# Altium project mcHFPro_rf.PrjPcb (part 1 of 2)
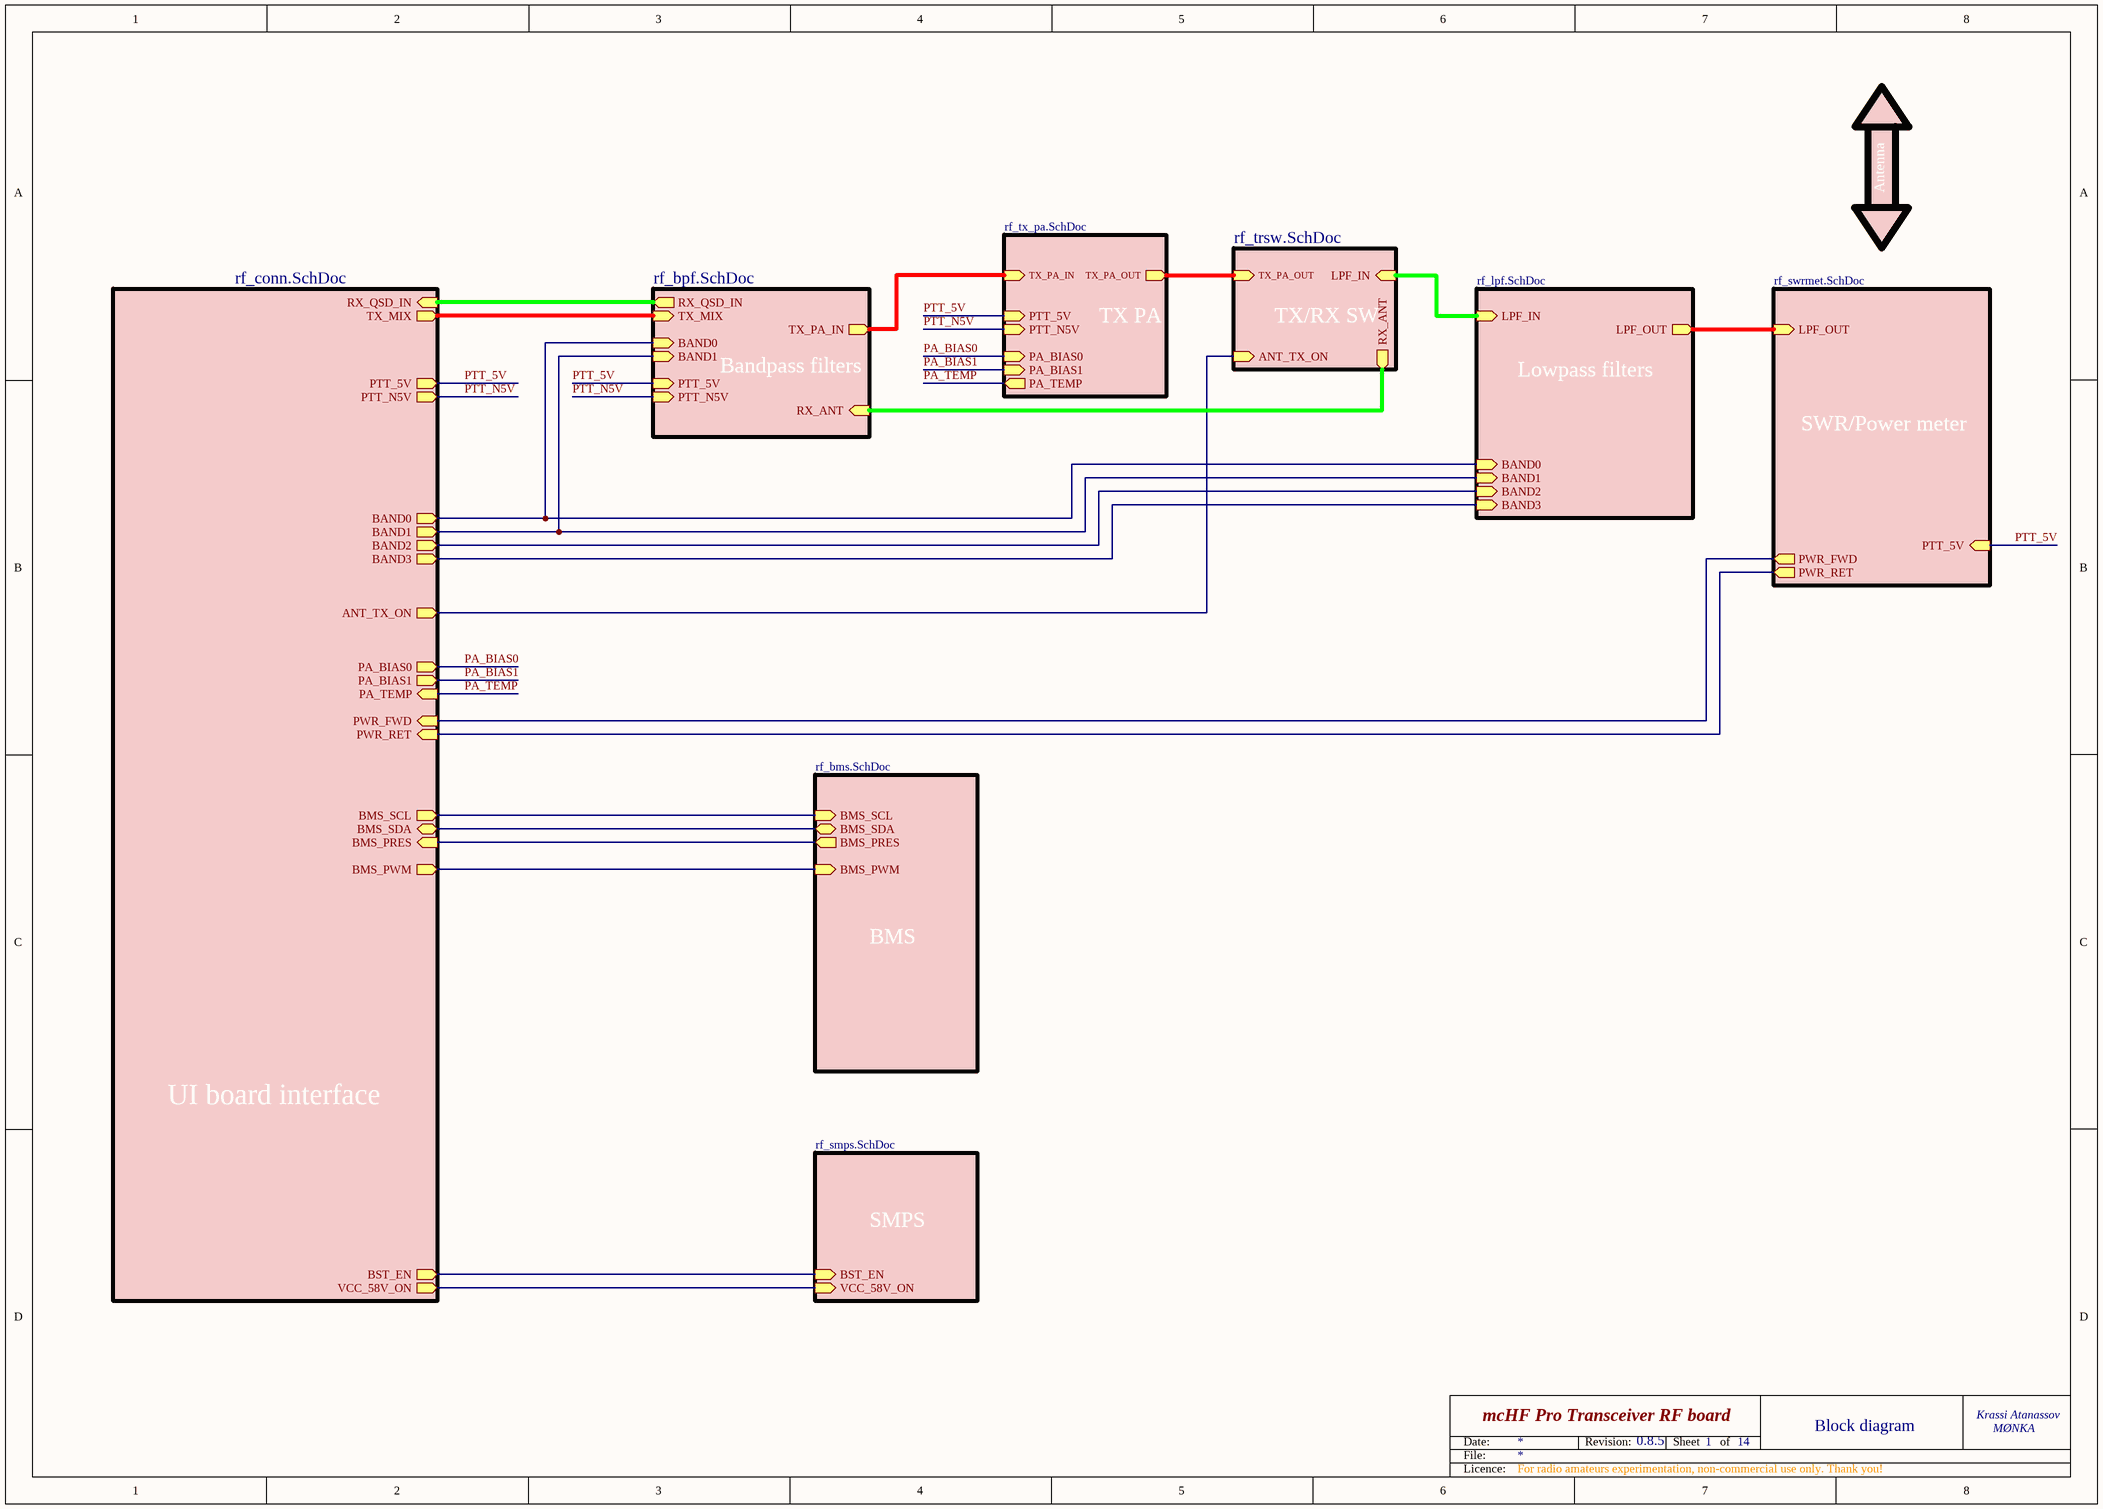
[diagram p0: rf_main.SchDoc]
14 sheets, 387 parts. Net scope: hierarchical (ports join the sheet entries above them; power ports are global).
Board file: mchf_pro_rf.PcbDoc
Sheets:
  rf_main.SchDoc
    TX PA = rf_tx_pa.SchDoc
    Bandpass filters = rf_bpf.SchDoc
    Lowpass filters = rf_lpf.SchDoc
      30/20m = rf_lpf_30_20.SchDoc
      60/40m = rf_lpf_60_40.SchDoc
      80m = rf_lpf_80.SchDoc
      160m = rf_lpf_160.SchDoc
      17-10m = rf_lpf_17_10.SchDoc
    UI board interface = rf_conn.SchDoc
    BMS = rf_bms.SchDoc
    SMPS = rf_smps.SchDoc
    TX/RX SW = rf_trsw.SchDoc
    SWR/Power meter = rf_swrmet.SchDoc

## Sheet rf_main.SchDoc: mcHF Pro Transceiver RF board
size A3; Author: Krassi Atanassov; CompanyName: MØNKA; Engineer: For radio amateurs experimentation, non-commercial use only. Thank you!; Revision: 0.8.5; SheetTotal: 14

### Sub-sheets
Bandpass filters = rf_bpf.SchDoc: BAND0 (in), BAND1 (in), PTT_5V (in), RX_ANT (in), TX_PA_IN (out), PTT_N5V (in), RX_QSD_IN (out), TX_MIX (in)
BMS = rf_bms.SchDoc: BMS_SCL (in), BMS_SDA (bidir), BMS_PRES (out), BMS_PWM (in)
Lowpass filters = rf_lpf.SchDoc: LPF_OUT (out), BAND0 (in), BAND1 (in), BAND2 (in), BAND3 (in), LPF_IN (in)
SMPS = rf_smps.SchDoc: VCC_58V_ON (in), BST_EN (in)
SWR/Power meter = rf_swrmet.SchDoc: LPF_OUT (in), PWR_FWD (out), PWR_RET (out), PTT_5V (in)
TX PA = rf_tx_pa.SchDoc: TX_PA_IN (in), PA_BIAS0 (in), TX_PA_OUT (out), PTT_N5V (in), PTT_5V (in), PA_BIAS1 (in), PA_TEMP (out)
TX/RX SW = rf_trsw.SchDoc: RX_ANT (out), ANT_TX_ON (in), LPF_IN (in), TX_PA_OUT (in)
UI board interface = rf_conn.SchDoc: PTT_5V (out), PTT_N5V (out), PWR_FWD (in), PWR_RET (in), PA_BIAS0 (out), BAND0 (out), BAND1 (out), BAND2 (out), ANT_TX_ON (out), BAND3 (out), RX_QSD_IN (in), TX_MIX (out), VCC_58V_ON (out), PA_BIAS1 (out), BMS_SCL (out), BMS_SDA (bidir), BMS_PRES (in), PA_TEMP (in), BMS_PWM (out), BST_EN (out)

### Nets
ANT_TX_ON: sheet UI board interface/ANT_TX_ON, sheet TX/RX SW/ANT_TX_ON
BAND0: sheet Bandpass filters/BAND0, sheet Lowpass filters/BAND0, sheet UI board interface/BAND0
BAND1: sheet Bandpass filters/BAND1, sheet Lowpass filters/BAND1, sheet UI board interface/BAND1
BAND2: sheet Lowpass filters/BAND2, sheet UI board interface/BAND2
BAND3: sheet Lowpass filters/BAND3, sheet UI board interface/BAND3
BMS_PRES: sheet UI board interface/BMS_PRES, sheet BMS/BMS_PRES
BMS_PWM: sheet UI board interface/BMS_PWM, sheet BMS/BMS_PWM
BMS_SCL: sheet UI board interface/BMS_SCL, sheet BMS/BMS_SCL
BMS_SDA: sheet UI board interface/BMS_SDA, sheet BMS/BMS_SDA
BST_EN: sheet UI board interface/BST_EN, sheet SMPS/BST_EN
PA_BIAS0: sheet TX PA/PA_BIAS0, sheet UI board interface/PA_BIAS0
PA_BIAS1: sheet TX PA/PA_BIAS1, sheet UI board interface/PA_BIAS1
PA_TEMP: sheet TX PA/PA_TEMP, sheet UI board interface/PA_TEMP
PTT_5V: sheet TX PA/PTT_5V, sheet Bandpass filters/PTT_5V, sheet UI board interface/PTT_5V, sheet SWR/Power meter/PTT_5V
PTT_N5V: sheet TX PA/PTT_N5V, sheet Bandpass filters/PTT_N5V, sheet UI board interface/PTT_N5V
PWR_FWD: sheet UI board interface/PWR_FWD, sheet SWR/Power meter/PWR_FWD
PWR_RET: sheet UI board interface/PWR_RET, sheet SWR/Power meter/PWR_RET
RX_QSD_IN: sheet Bandpass filters/RX_QSD_IN, sheet UI board interface/RX_QSD_IN
TX_MIX: sheet Bandpass filters/TX_MIX, sheet UI board interface/TX_MIX
VCC_58V_ON: sheet UI board interface/VCC_58V_ON, sheet SMPS/VCC_58V_ON
NetC91_2: sheet TX PA/TX_PA_IN, sheet Bandpass filters/TX_PA_IN
NetC136_1: sheet Bandpass filters/RX_ANT, sheet TX/RX SW/RX_ANT
NetK5_5: sheet TX PA/TX_PA_OUT, sheet TX/RX SW/TX_PA_OUT
NetK5_6: sheet Lowpass filters/LPF_IN, sheet TX/RX SW/LPF_IN
NetM12_2: sheet Lowpass filters/LPF_OUT, sheet SWR/Power meter/LPF_OUT

### Notes on the sheet
- Antenna
- 1
- Block diagram
- Date:
- File:
- Revision:
- Sheet
- of
- Licence:

## Sheet rf_tx_pa.SchDoc: mcHF Pro Transceiver RF board
size A3; Author: Krassi Atanassov; CompanyName: MØNKA; Engineer: For radio amateurs experimentation, non-commercial use only. Thank you!; Revision: 0.8.5; SheetTotal: 14
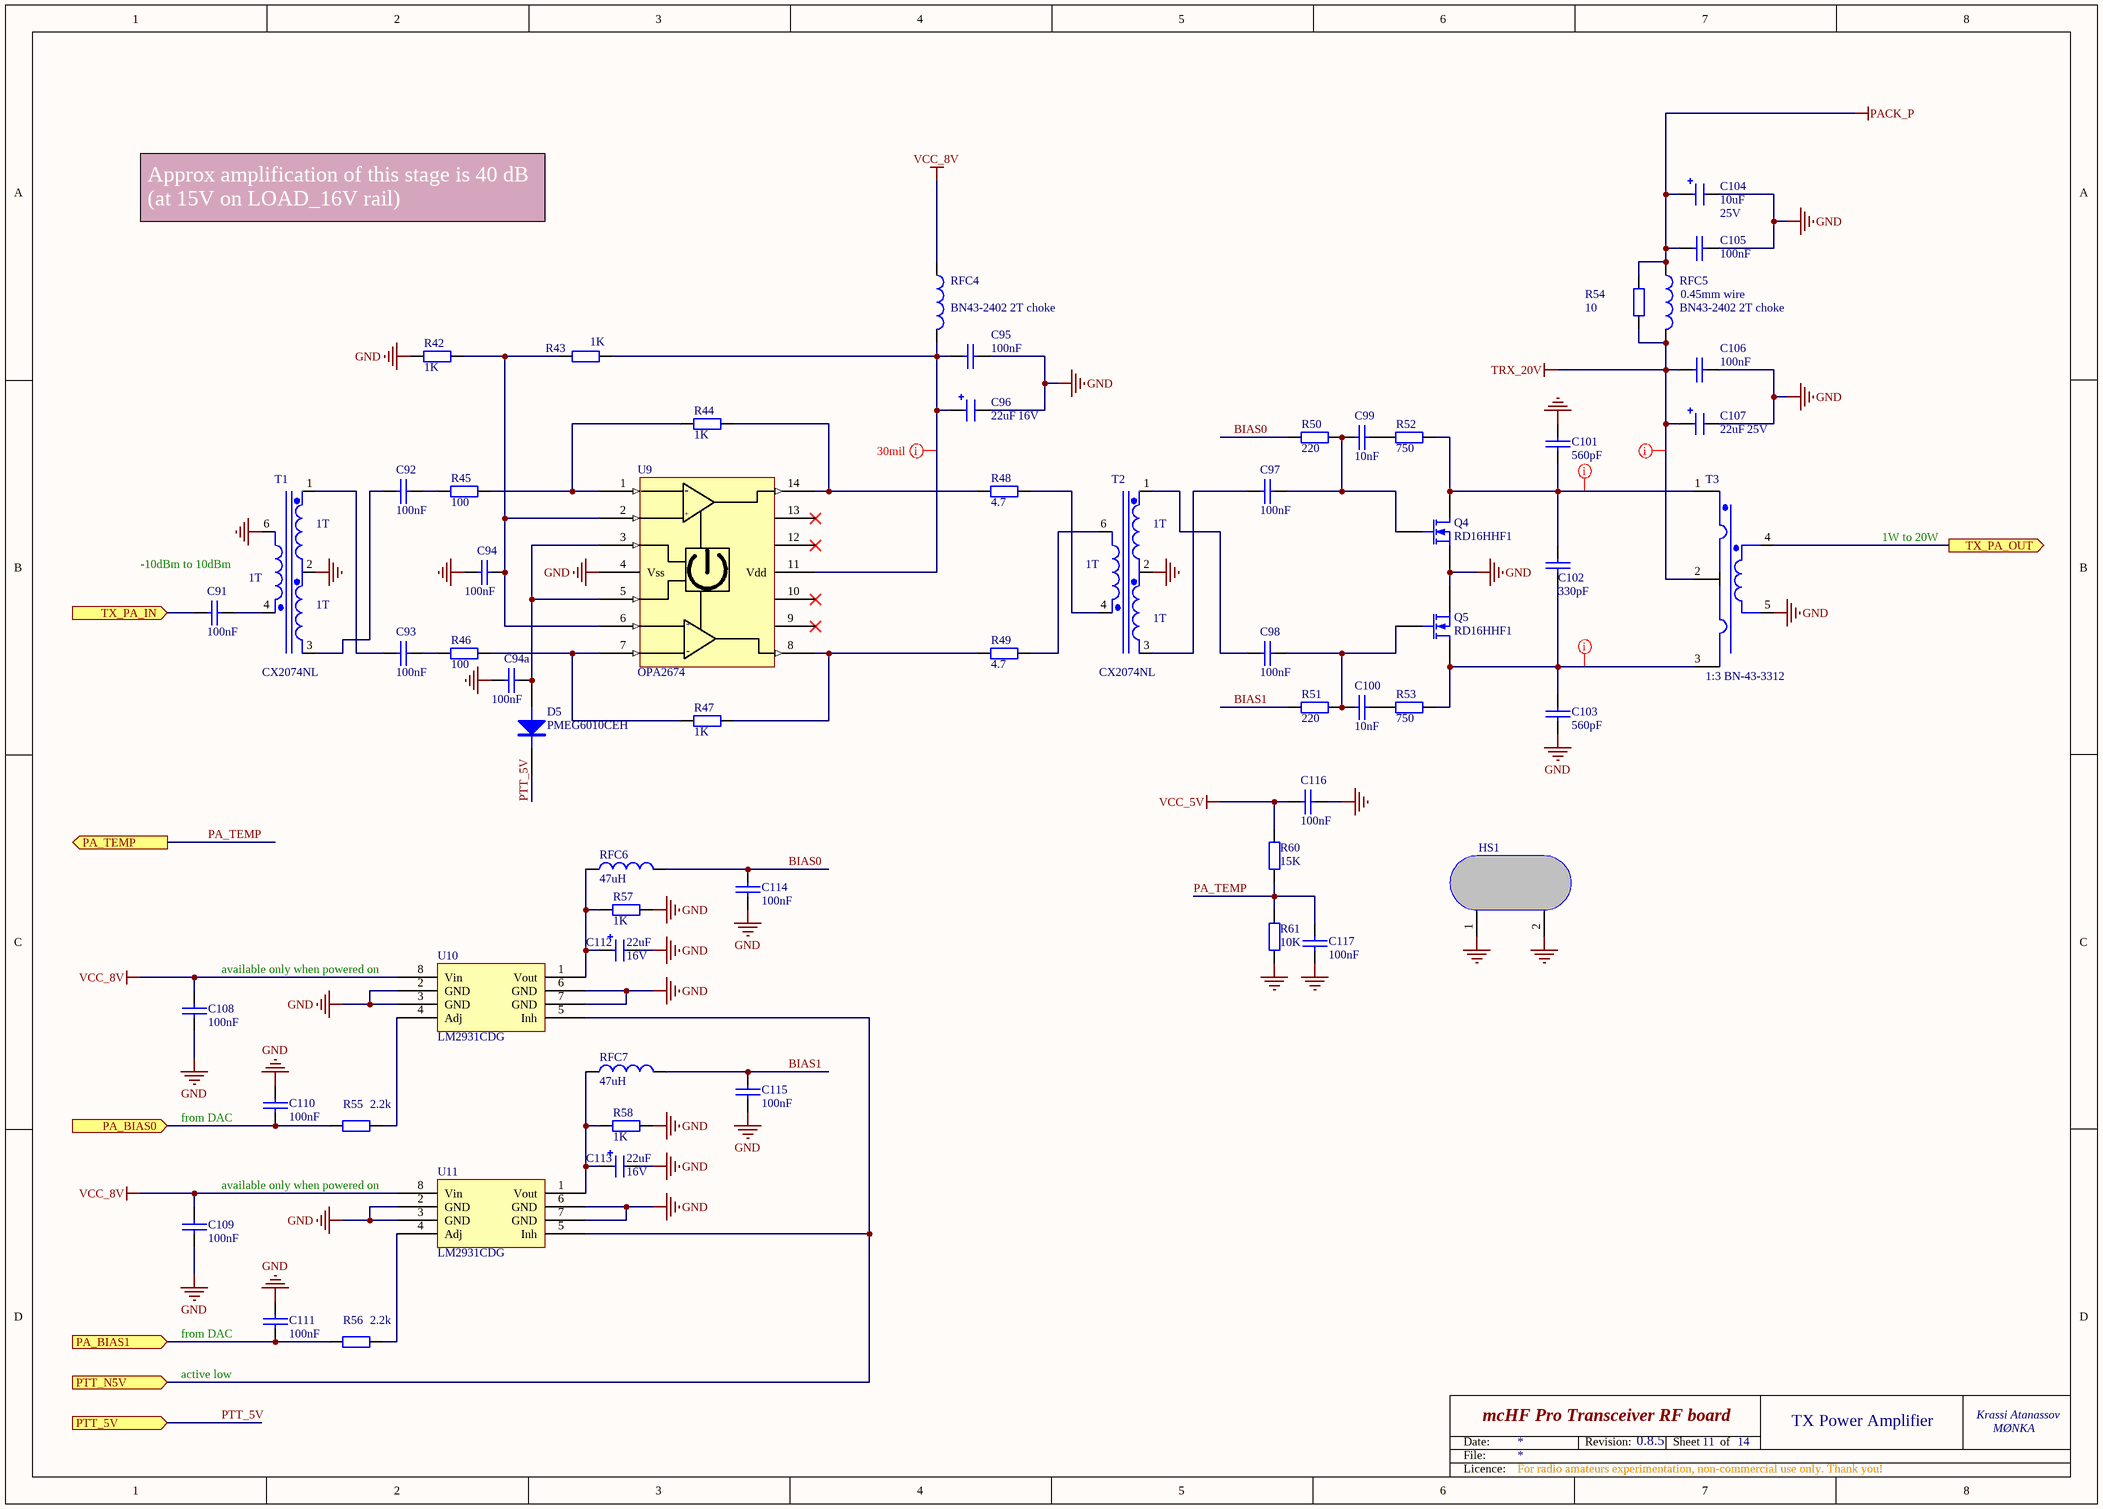
[diagram p1: rf_tx_pa.SchDoc]

### Parts
C91  100nF  [0805]
C92  100nF  [0805]
C93  100nF  [0805]
C94  100nF  [0805]
C94a  100nF  [0805]
C95  100nF  [0805]
C96  22uF  Voltage: 16V  [1206_Elec_Cap]
C97  100nF  [0805]
C98  100nF  [0805]
C99  10nF  [0805]
C100  10nF  [0805]
C101  560pF  [0805]
C102  330pF  [0805]
C103  560pF  [0805]
C104  10uF  Voltage: 25V  [1206_Elec_Cap]
C105  100nF  [0805]
C106  100nF  [0805]
C107  22uF  Voltage: 25V  [1206_Elec_Cap]
C108  100nF  [0805]
C109  100nF  [0805]
C110  100nF  [0805]
C111  100nF  [0805]
C112  22uF  Voltage: 16V  [1206_Elec_Cap]
C113  22uF  Voltage: 16V  [1206_Elec_Cap]
C114  100nF  [0805]
C115  100nF  [0805]
C116  100nF  [0805]
C117  100nF  [0805]
D5  PMEG6010CEH  [SOD87]
HS1  RD16HHF1x2  [TO-220_5_DUAL_HS]  (value not drawn)
Q4  RD16HHF1  [TO-220c]
Q5  RD16HHF1  [TO-220c]
R42  1K  [0805]
R43  1K  [0805]
R44  1K  [0805]
R45  100  [0805]
R46  100  [0805]
R47  1K  [0805]
R48  4.7  [0805]
R49  4.7  [0805]
R50  220  [0805]
R51  220  [0805]
R52  750  [0805]
R53  750  [0805]
R54  10  [0805]
R55  2.2k  [0805]
R56  2.2k  [0805]
R57  1K  [0805]
R58  1K  [0805]
R60  15K  [0805]
R61  10K  [0805]
RFC4  BN43-2402 2T choke  [F_Bead_Flat]
RFC5  BN43-2402 2T choke  [F_Bead]
RFC6  47uH  [0805]
RFC7  47uH  [0805]
T1  CX2074NL  [SOP5_NEW1]
T2  CX2074NL  [SOP5_NEW1]
T3  1:3 BN-43-3312  [PA_OUT_TRM]
U9  OPA2674  [SO-14-PRO]
U10  LM2931CDG  [SO-8-PRO]
U11  LM2931CDG  [SO-8-PRO]

### Ports
PA_BIAS0 (in), PA_BIAS1 (in), PA_TEMP (out), PTT_5V (in), PTT_N5V (in), TX_PA_IN (in), TX_PA_OUT (out)

### Nets
GND: C94.1 C94a.1 C95.1 C96.2 C101.1 C103.2 C104.2 C105.1 C106.1 C107.2 C108.2 C109.2 C110.2 C111.1 C112.2 C113.2 C114.1 C115.1 C116.1 C117.2 HS1.1(GND) HS1.2(GND) Q4.2(S) Q5.2(S) R42.1 R57.1 R58.1 R61.2 T1.2(SecCmn) T1.6(Pri+) T2.2(SecCmn) T3.5(Sec-) U9.4(Vss) U10.2(GND) U10.3(GND) U10.6(GND) U10.7(GND) U11.2(GND) U11.3(GND) U11.6(GND) U11.7(GND)
PACK_P: C104.1 C105.2 R54.2 RFC5.1
TRX_20V: C106.2 C107.1 R54.1 RFC5.2 T3.2(Pri_Common)
VCC_5V: C116.2 R60.1
VCC_8V: C108.1 C109.1 RFC4.1 U10.8(Vin) U11.8(Vin)
BIAS0: C114.2 R50.2 RFC6.2
BIAS1: C115.2 R51.2 RFC7.2
PA_BIAS0: C110.1 R55.1 ; port PA_BIAS0
PA_BIAS1: C111.2 R56.1 ; port PA_BIAS1
PA_TEMP: C117.1 R60.2 R61.1 ; port PA_TEMP
PTT_5V: D5.2(K) ; port PTT_5V
PTT_N5V: U10.5(Inh) U11.5(Inh) ; port PTT_N5V
NetC91_1: C91.1 T1.4(Pri-)
NetC91_2: C91.2 ; port TX_PA_IN
NetC92_1: C92.1 T1.3(Sec180)
NetC92_2: C92.2 R45.2
NetC93_1: C93.1 T1.1(Sec0)
NetC93_2: C93.2 R46.2
NetC94_2: C94.2 R42.2 R43.2 U9.2 U9.6
NetC94a_2: C94a.2 D5.1(A) U9.3 U9.5
NetC95_2: C95.2 C96.1 R43.1 RFC4.2 U9.11(Vdd)
NetC97_1: C97.1 C99.1 Q4.1(G) R50.1
NetC97_2: C97.2 T2.3(Sec180)
NetC98_1: C98.1 C100.1 Q5.1(G) R51.1
NetC98_2: C98.2 T2.1(Sec0)
NetC99_2: C99.2 R52.2
NetC100_2: C100.2 R53.2
NetC101_2: C101.2 C102.1 Q4.3(D) R52.1 T3.1(Pri_0_deg)
NetC102_2: C102.2 C103.1 Q5.3(D) R53.1 T3.3(Pri_180_deg)
NetC112_1: C112.1 R57.2 RFC6.1 U10.1(Vout)
NetC113_1: C113.1 R58.2 RFC7.1 U11.1(Vout)
NetK5_5: T3.4(Sec+) ; port TX_PA_OUT
NetR44_1: R44.1 R48.2 U9.14
NetR44_2: R44.2 R45.1 U9.1
NetR46_1: R46.1 R47.2 U9.7
NetR47_1: R47.1 R49.2 U9.8
NetR48_1: R48.1 T2.4(Pri-)
NetR49_1: R49.1 T2.6(Pri+)
NetR55_2: R55.2 U10.4(Adj)
NetR56_2: R56.2 U11.4(Adj)

Not connected (* = marked no-connect by the designer): U9 9* 10* 12* 13*

### Layout directives
rule Width Constraint [Pref Width = 50mil    Min Width = 50mil    Max Width = 50mil]: NetC101_2, NetC102_2
rule Width Constraint [Pref Width = 30mil    Min Width = 30mil    Max Width = 30mil]: NetC95_2
rule Width Constraint [Pref Width = 80mil    Min Width = 80mil    Max Width = 80mil]: TRX_20V

### Notes on the sheet
- Approx amplification of this stage is 40 dB  (at 15V on LOAD_16V rail)
- (near RFC5) 0.45mm wire
- -10dBm to 10dBm
- (near T1) 1T
- (near T2) 1T
- 1W to 20W
- available only when powered on
- (near C110) from DAC
- (near C111) active low
- (near C111) from DAC
- 11
- TX Power Amplifier
- Date:
- File:
- Revision:
- Sheet
- of
- Licence:
- (in symbol OPA2674) -; +

### Library data of the parts
C91 C110 C111 = CAP: Capacitor; QT Order: QCC-00154; Price: 0.068
C92-C94 C94a C95 C97-C103 C105 C106 C108 C109 C114-C117 = CAP: Capacitor; Voltage: 100V; QT Order: QCC-00154; Price: 0.068
C96 C107 C112 C113 = CAP-POL: Electrolitic capacitor; QT Order: QCC-00202; Price: 0.235
C104 = CAP-POL: Electrolitic capacitor; QT Order: QCC-00166; Price: 0.204
D5 = PMEG6010CEH: DIODE, SCHOTTKY, 1A, 60V, SOD-123F; QT Order: QCD-00034; Price: 0.085
HS1 = RD16HHF1_DUAL_HEATSINK: RF MOSFET x2 heatsink; Order: EB 121171160336; Price: 7.375
Q4 Q5 = RD16HHF1: Silicon RF Power MOS FET; Order: EB 121171160336; Price: 7.375
R42-R44 R47-R49 R57 R58 R60 R61 = RES: Resistor; QT Order: QCR-00579; Price: 0.061
R45 R46 R50-R53 = RES: Resistor; QT Order: QCR-00309; Price: 0.007
R54 = RES: Resistor; QT Order: QCR-00279; Price: 0.013
R55 R56 = RES: Resistor; QT Order: QCR-00333; Price: 0.046
RFC4 RFC5 = FER_BEAD: BN43-2402 1t choke; Notes: post assembly; Price: 0.298
RFC6 RFC7 = TDK-NLV25T: INDUCTOR, SIGNAL LINE, 4.7UH, 1005; Price: 0.166
T1 T2 = CX2074NL: Transformer 4:1; Price: 0.298
T3 = PA_OUT_TR: 1:3 BN-43-3312 transformer; Notes: post assembly; Price: 0.534
U9 = OPA2674: Dual Wideband, High Output Current / Operational Amplifier with Current Limit; Price: 0.38
U10 U11 = LM2931CDG: 100 mA, Adjustable Output,  LDO Voltage Regulator with  60 V Load Dump Protection; Price: 0.39

## Sheet rf_bpf.SchDoc: mcHF Pro Transceiver RF board
size A3; Author: Krassi Atanassov; CompanyName: MØNKA; Engineer: For radio amateurs experimentation, non-commercial use only. Thank you!; Revision: 0.8.5; SheetTotal: 14
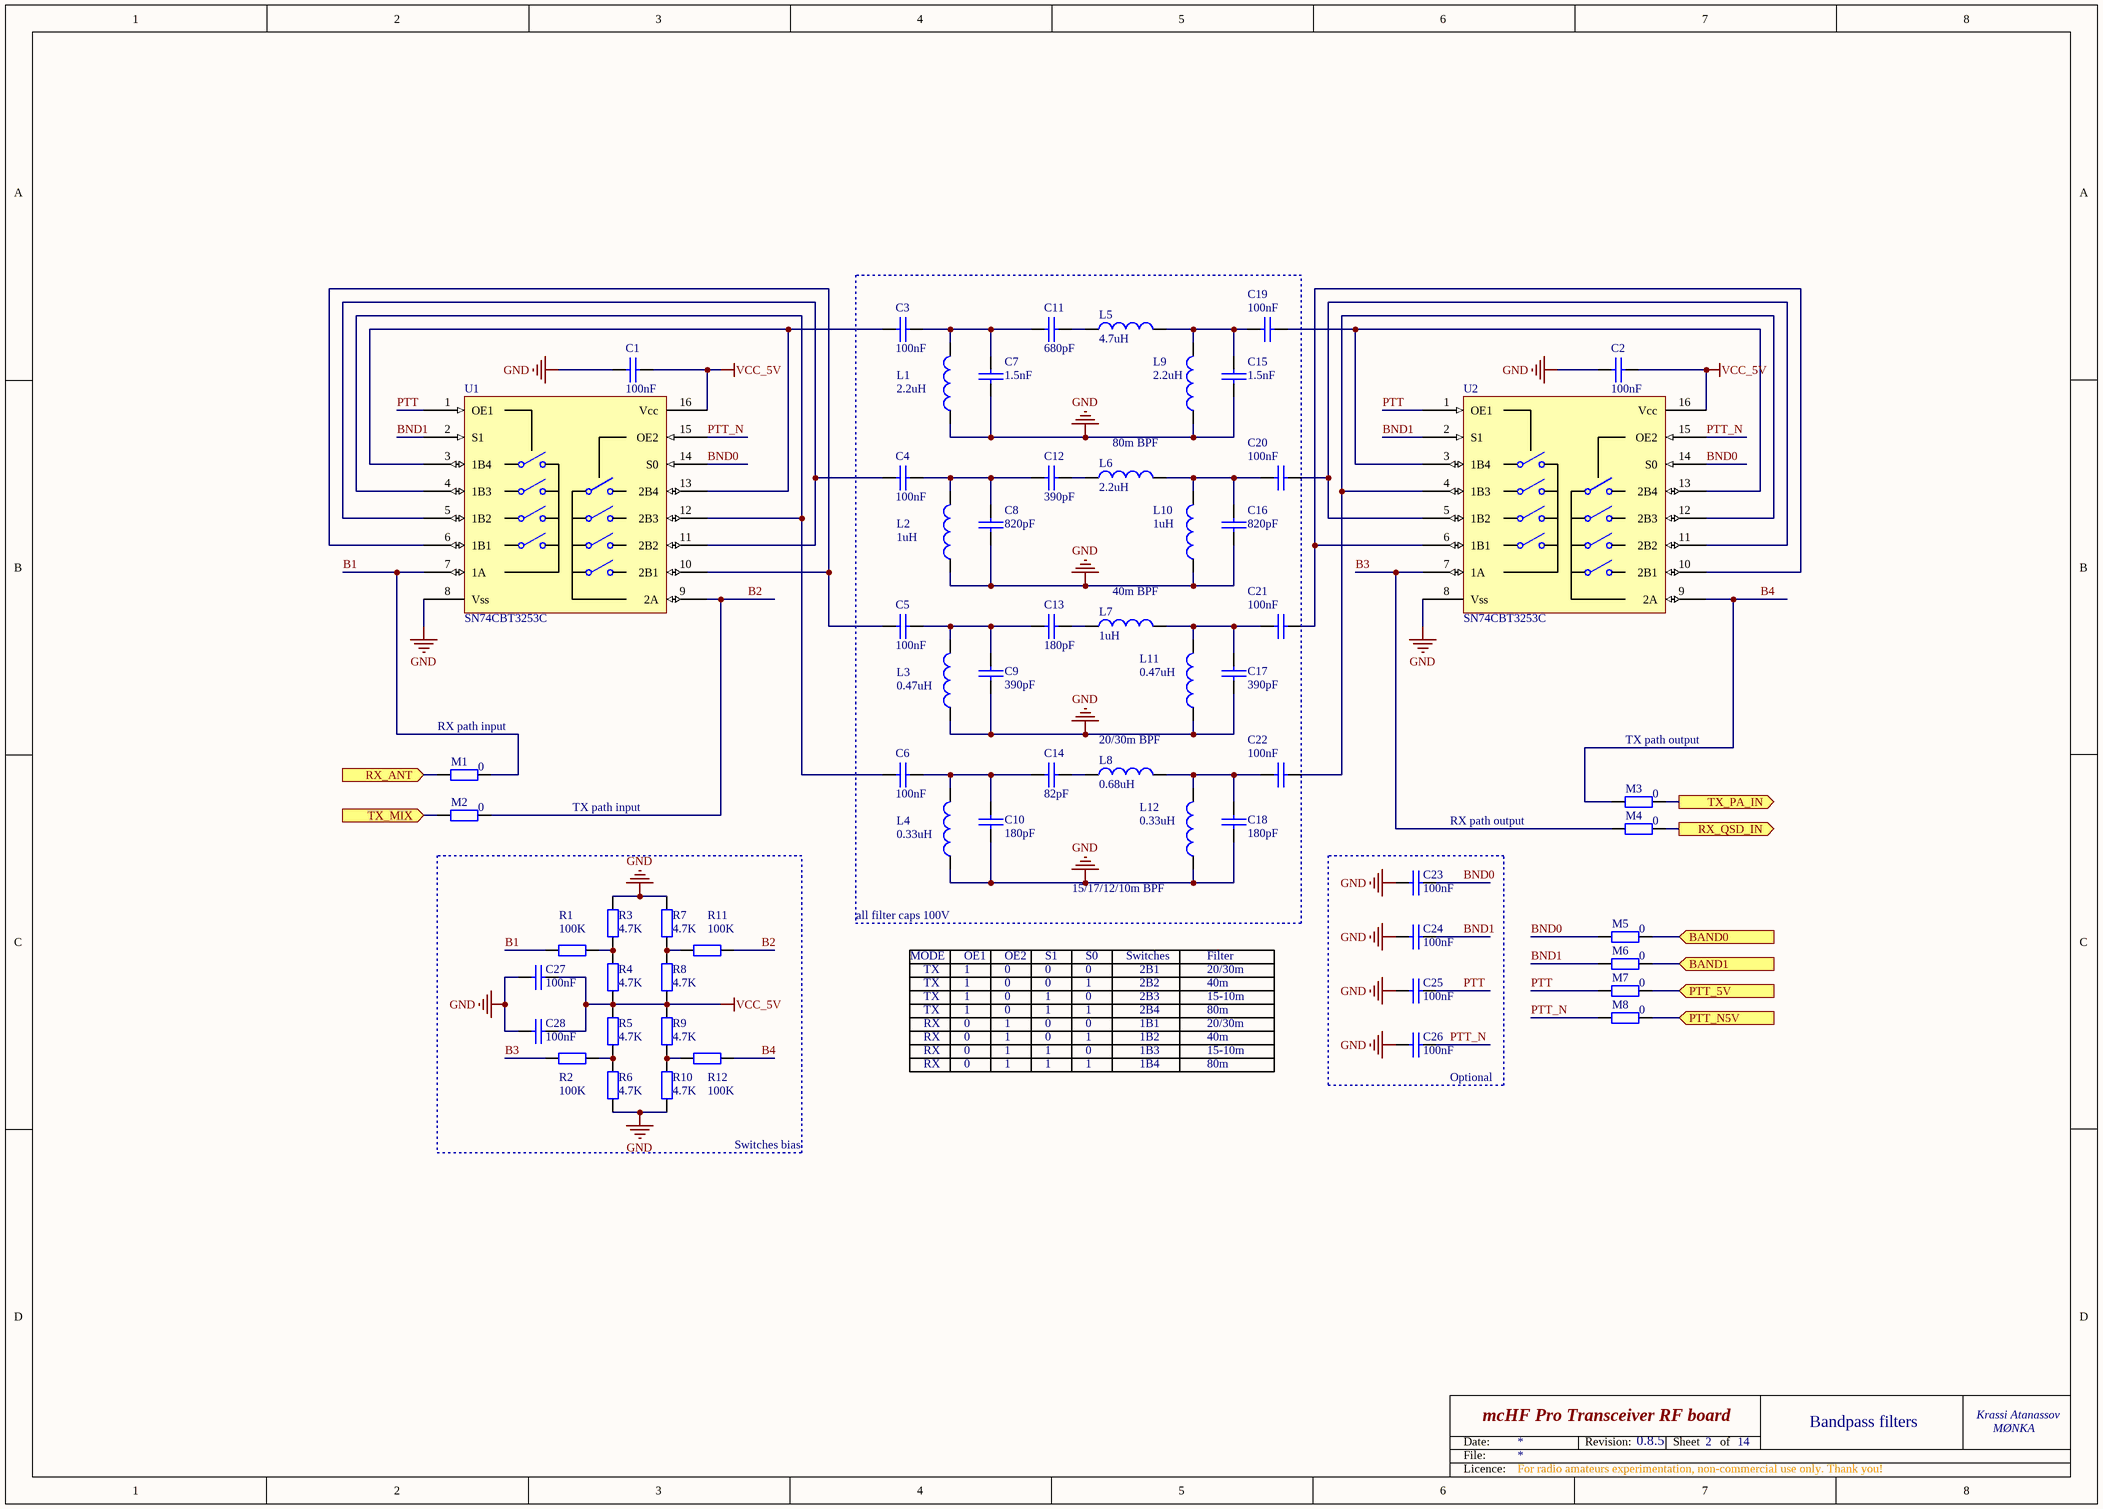
[diagram p2: rf_bpf.SchDoc]

### Parts
C1  100nF  [0805]
C2  100nF  [0805]
C3  100nF  [0805]
C4  100nF  [0805]
C5  100nF  [0805]
C6  100nF  [0805]
C7  1.5nF  [0805]
C8  820pF  [0805]
C9  390pF  [0805]
C10  180pF  [0805]
C11  680pF  [0805]
C12  390pF  [0805]
C13  180pF  [0805]
C14  82pF  [0805]
C15  1.5nF  [0805]
C16  820pF  [0805]
C17  390pF  [0805]
C18  180pF  [0805]
C19  100nF  [0805]
C20  100nF  [0805]
C21  100nF  [0805]
C22  100nF  [0805]
C23  100nF  [0805]
C24  100nF  [0805]
C25  100nF  [0805]
C26  100nF  [0805]
C27  100nF  [0805]
C28  100nF  [0805]
L1  2.2uH  [0805]
L2  1uH  [0805]
L3  0.47uH  [0805]
L4  0.33uH  [0805]
L5  4.7uH  [0805]
L6  2.2uH  [0805]
L7  1uH  [0805]
L8  0.68uH  [0805]
L9  2.2uH  [0805]
L10  1uH  [0805]
L11  0.47uH  [0805]
L12  0.33uH  [0805]
M1  0  [0805]
M2  0  [0805]
M3  0  [0805]
M4  0  [0805]
M5  0  [0805]
M6  0  [0805]
M7  0  [0805]
M8  0  [0805]
R1  100K  [0805]
R2  100K  [0805]
R3  4.7K  [0805]
R4  4.7K  [0805]
R5  4.7K  [0805]
R6  4.7K  [0805]
R7  4.7K  [0805]
R8  4.7K  [0805]
R9  4.7K  [0805]
R10  4.7K  [0805]
R11  100K  [0805]
R12  100K  [0805]
U1  SN74CBT3253C  [SO-16]
U2  SN74CBT3253C  [SO-16]

### Blocks framed on the sheet
Switches bias: C27 C28 R1-R12
Optional: C23-C26

### Ports
BAND0 (in), BAND1 (in), PTT_5V (in), PTT_N5V (in), RX_ANT (in), RX_QSD_IN (out), TX_MIX (in), TX_PA_IN (out)

### Nets
GND: C1.2 C2.2 C7.2 C8.2 C9.1 C10.1 C15.2 C16.2 C17.1 C18.1 C23.2 C24.2 C25.2 C26.2 C27.2 C28.2 L1.1 L2.1 L3.1 L4.1 L9.1 L10.1 L11.1 L12.1 R3.1 R6.2 R7.1 R10.2 U1.8(Vss) U2.8(Vss)
VCC_5V: C1.1 C2.1 C27.1 C28.1 R4.2 R5.1 R8.2 R9.1 U1.16(Vcc) U2.16(Vcc)
B1: M1.1 R1.1 U1.7(1A)
B2: M2.1 R11.2 U1.9(2A)
B3: M4.2 R2.1 U2.7(1A)
B4: M3.2 R12.2 U2.9(2A)
BAND0: M5.1 ; port BAND0
BAND1: M6.1 ; port BAND1
BND0: C23.1 M5.2 U1.14(S0) U2.14(S0)
BND1: C24.1 M6.2 U1.2(S1) U2.2(S1)
PTT: C25.1 M7.2 U1.1(OE1) U2.1(OE1)
PTT_5V: M7.1 ; port PTT_5V
PTT_N: C26.1 M8.2 U1.15(OE2) U2.15(OE2)
PTT_N5V: M8.1 ; port PTT_N5V
RX_QSD_IN: M4.1 ; port RX_QSD_IN
TX_MIX: M2.2 ; port TX_MIX
NetC3_1: C3.1 C7.1 C11.1 L1.2
NetC3_2: C3.2 U1.3(1B4) U1.13(2B4)
NetC4_1: C4.1 C8.1 C12.1 L2.2
NetC4_2: C4.2 U1.5(1B2) U1.11(2B2)
NetC5_1: C5.1 C9.2 C13.1 L3.2
NetC5_2: C5.2 U1.6(1B1) U1.10(2B1)
NetC6_1: C6.1 C10.2 C14.1 L4.2
NetC6_2: C6.2 U1.4(1B3) U1.12(2B3)
NetC11_2: C11.2 L5.1
NetC12_2: C12.2 L6.1
NetC13_2: C13.2 L7.1
NetC14_2: C14.2 L8.1
NetC15_1: C15.1 C19.2 L5.2 L9.2
NetC16_1: C16.1 C20.2 L6.2 L10.2
NetC17_2: C17.2 C21.2 L7.2 L11.2
NetC18_2: C18.2 C22.2 L8.2 L12.2
NetC19_1: C19.1 U2.3(1B4) U2.13(2B4)
NetC20_1: C20.1 U2.5(1B2) U2.11(2B2)
NetC21_1: C21.1 U2.6(1B1) U2.10(2B1)
NetC22_1: C22.1 U2.4(1B3) U2.12(2B3)
NetC91_2: M3.1 ; port TX_PA_IN
NetC136_1: M1.2 ; port RX_ANT
NetR1_2: R1.2 R3.2 R4.1
NetR2_2: R2.2 R5.2 R6.1
NetR7_2: R7.2 R8.1 R11.1
NetR9_2: R9.2 R10.1 R12.1

### Notes on the sheet
- (near L6) 80m BPF
- (near L7) 40m BPF
- (near M1) RX path input
- 20/30m BPF
- TX path output
- TX path input
- RX path output
- all filter caps 100V
- (near L12) 15/17/12/10m BPF
- MODE
- TX
- OE1
- 1
- 0
- OE2
- S1
- S0
- Switches
- 2B1
- 2B2
- Filter
- 20/30m
- 40m
- RX
- 2B4
- 2B3
- 1B2
- 1B3
- 1B1
- 15-10m
- 80m
- 1B4
- 2
- Bandpass filters
- Date:
- File:
- Revision:
- Sheet
- of
- Licence:

### Library data of the parts
C1-C6 C19-C28 = CAP: Capacitor; QT Order: QCC-00154; Price: 0.068
C7 C15 = CAP: Capacitor; QT Order: QCC-00082; Notes: COG/NPO; Price: 0.124
C8 C16 = CAP: Capacitor; QT Order: QCC-00147; Notes: COG/NPO; Price: 0.074
C9 C12 C17 = CAP: Capacitor; QT Order: QCC-00125; Notes: COG/NPO; Price: 0.078
C10 C13 C18 = CAP: Capacitor; QT Order: QCC-00084; Notes: COG/NPO; Price: 0.058
C11 = CAP: Capacitor; Notes: COG/NPO; Price: 0.074
C14 = CAP: Capacitor; QT Order: QCC-00069; Notes: COG/NPO; Price: 0.074
L1-L12 = BPF_IND: INDUCTOR SMD; Price: 0.166
M1-M8 = RES: Resistor; QT Order: QCR-00268; Price: 0.009
R1 R2 R11 R12 = RES: Resistor; QT Order: QCR-00373; Price: 0.021
R3-R10 = RES: Resistor; QT Order: QCR-00341; Price: 0.024
U1 U2 = SN74CBT3253C: Dual 4:1 Demux/Analog Switch; Price: 0.69

## Sheet rf_lpf.SchDoc: mcHF Pro Transceiver RF board
size A3; Author: Krassi Atanassov; CompanyName: MØNKA; Engineer: For radio amateurs experimentation, non-commercial use only. Thank you!; Revision: 0.8.2; SheetTotal: 14
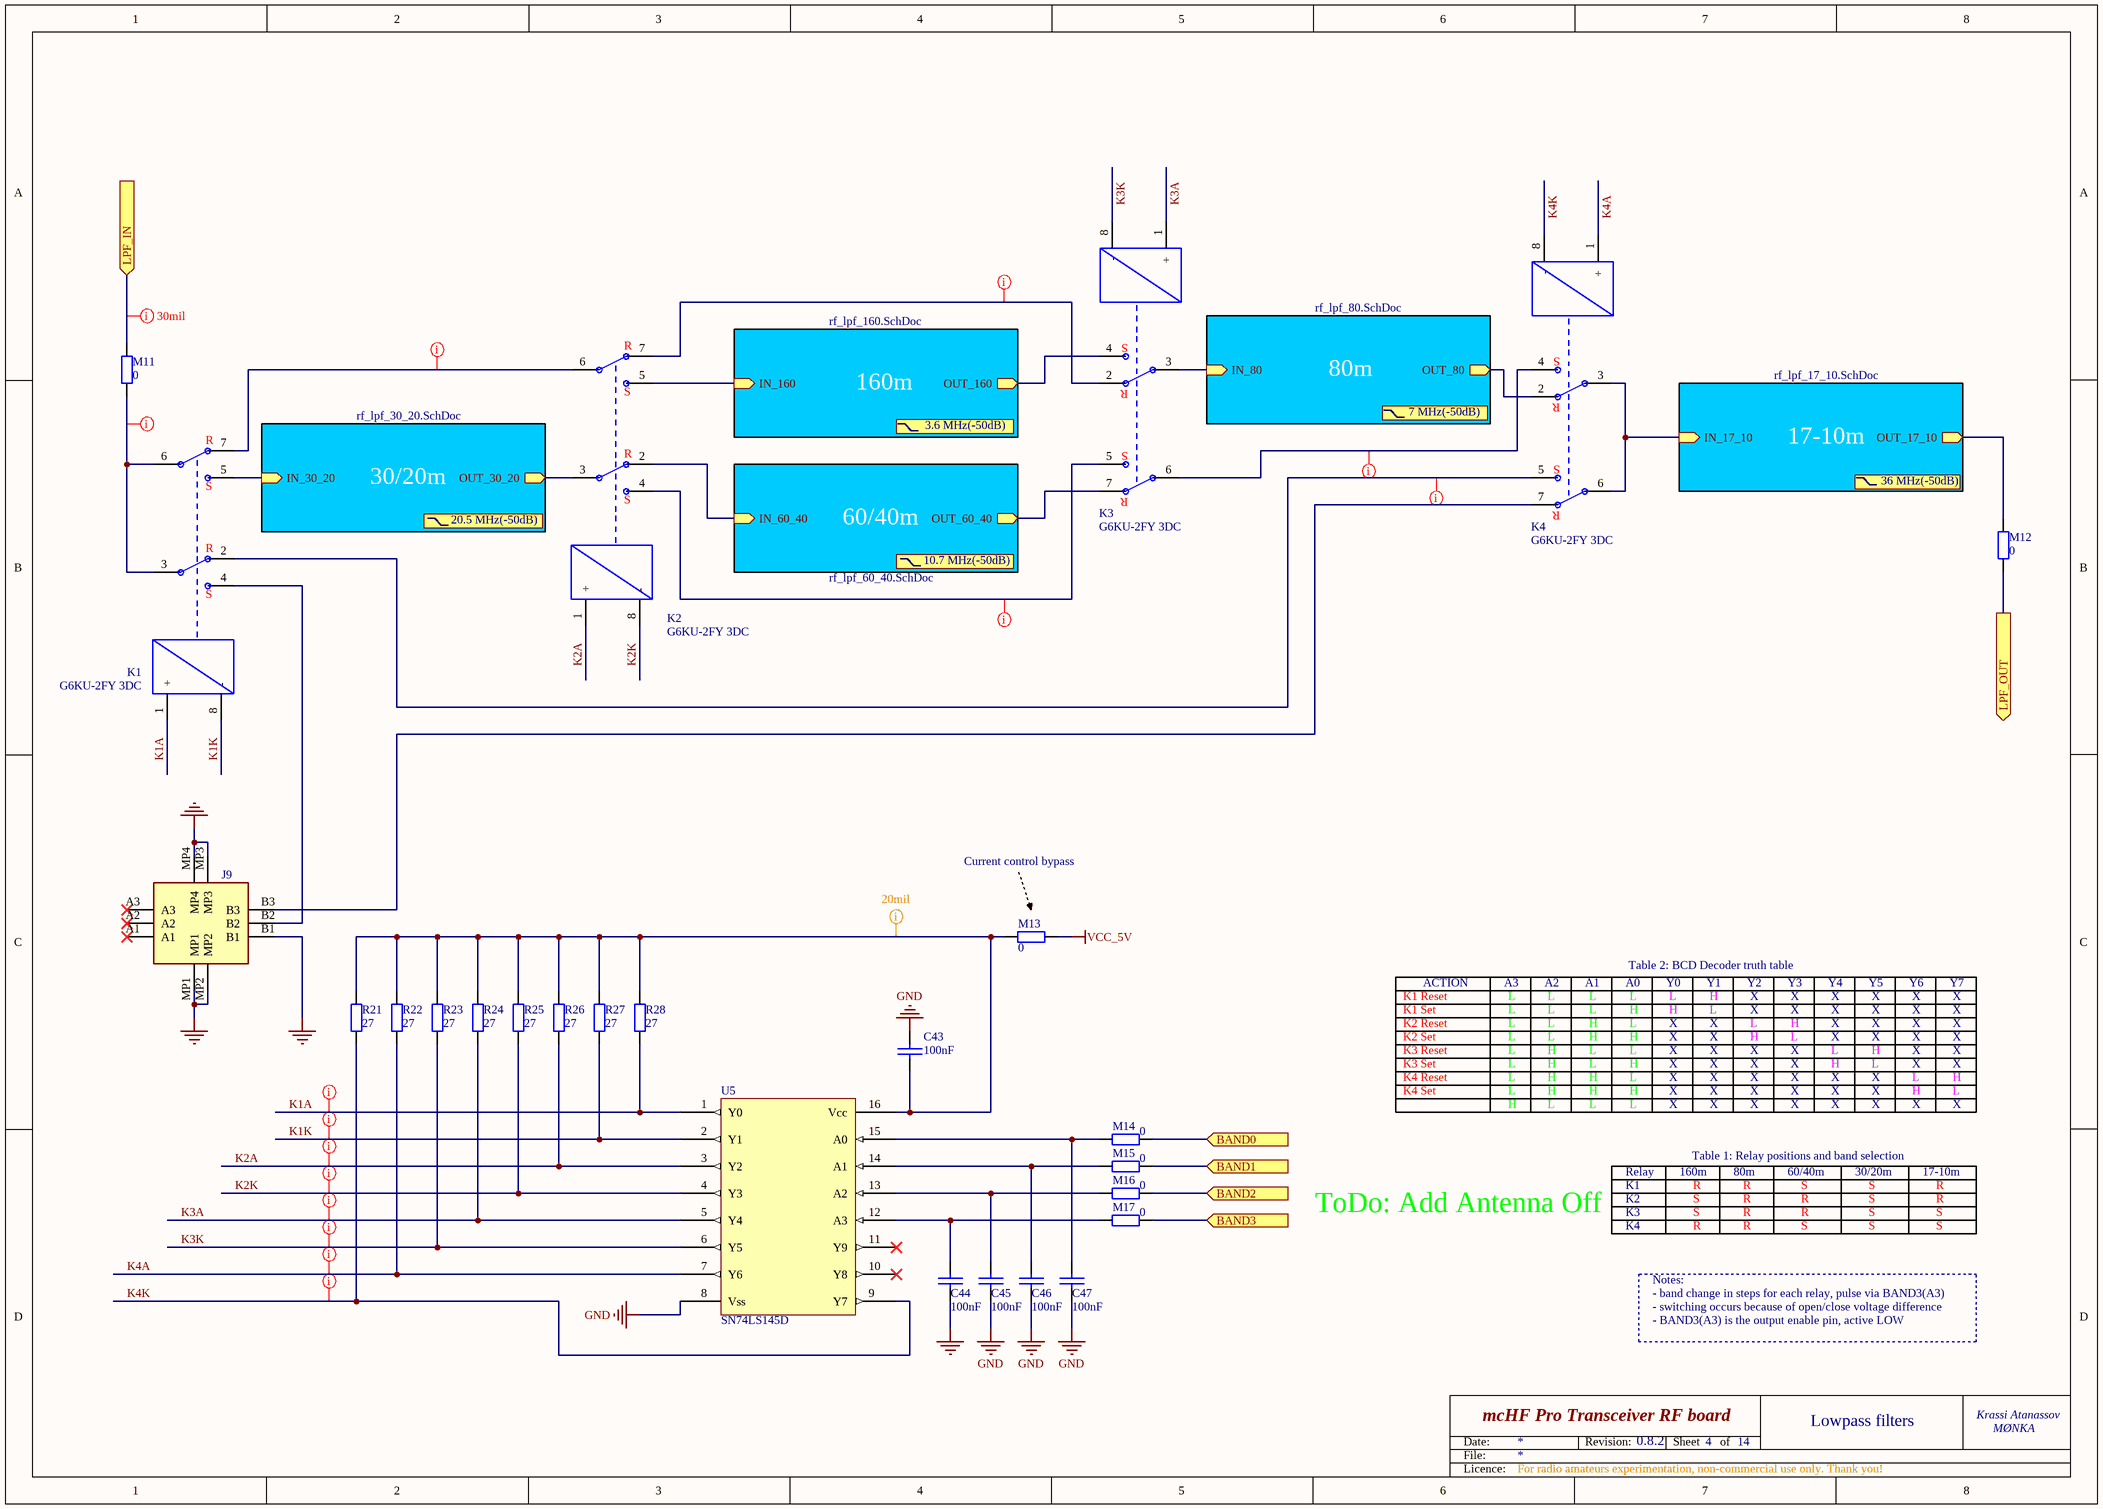
[diagram p3: rf_lpf.SchDoc]

### Parts
C43  100nF  [0805]
C44  100nF  [0805]
C45  100nF  [0805]
C46  100nF  [0805]
C47  100nF  [0805]
J9  1373826  [1373826]  (value not drawn)
K1  G6KU-2FY 3DC  [Omron_2FY-Pro]
K2  G6KU-2FY 3DC  [Omron_2FY-Pro]
K3  G6KU-2FY 3DC  [Omron_2FY-Pro]
K4  G6KU-2FY 3DC  [Omron_2FY-Pro]
M11  0  [0805]
M12  0  [0805]
M13  0  [0805]
M14  0  [0805]
M15  0  [0805]
M16  0  [0805]
M17  0  [0805]
R21  27  [1206]
R22  27  [1206]
R23  27  [1206]
R24  27  [1206]
R25  27  [1206]
R26  27  [1206]
R27  27  [1206]
R28  27  [1206]
U5  SN74LS145D  [SO-16]

### Sub-sheets
17-10m = rf_lpf_17_10.SchDoc: IN_17_10 (in), OUT_17_10 (out)
30/20m = rf_lpf_30_20.SchDoc: IN_30_20 (in), OUT_30_20 (out)
60/40m = rf_lpf_60_40.SchDoc: IN_60_40 (in), OUT_60_40 (out)
80m = rf_lpf_80.SchDoc: IN_80 (in), OUT_80 (out)
160m = rf_lpf_160.SchDoc: IN_160 (in), OUT_160 (out)

### Ports
BAND0 (in), BAND1 (in), BAND2 (in), BAND3 (in), LPF_IN (in), LPF_OUT (out)

### Nets
GND: C43.2 C44.1 C45.1 C46.1 C47.1 J9.B1 J9.MP1 J9.MP2 J9.MP3 J9.MP4 U5.8(Vss)
VCC_5V: M13.2
BAND0: M14.1 ; port BAND0
BAND1: M15.1 ; port BAND1
BAND2: M16.1 ; port BAND2
BAND3: M17.1 ; port BAND3
K1A: K1.1(+) R28.1 U5.1(Y0)
K1K: K1.8(-) R27.1 U5.2(Y1)
K2A: K2.1(+) R26.1 U5.3(Y2)
K2K: K2.8(-) R25.1 U5.4(Y3)
K3A: K3.1(+) R24.1 U5.5(Y4)
K3K: K3.8(-) R23.1 U5.6(Y5)
K4A: K4.1(+) R22.1 U5.7(Y6)
K4K: K4.8(-) R21.1 U5.9(Y7)
NetC43_1: C43.1 M13.1 R21.2 R22.2 R23.2 R24.2 R25.2 R26.2 R27.2 R28.2 U5.16(Vcc)
NetC44_2: C44.2 M17.2 U5.12(A3)
NetC45_2: C45.2 M16.2 U5.13(A2)
NetC46_2: C46.2 M15.2 U5.14(A1)
NetC47_2: C47.2 M14.2 U5.15(A0)
NetC48_2: K4.3 K4.6 ; sheet 17-10m/IN_17_10
NetC54_1: M12.1 ; sheet 17-10m/OUT_17_10
NetC56_2: K1.5 ; sheet 30/20m/IN_30_20
NetC59_1: K2.3 ; sheet 30/20m/OUT_30_20
NetC61_2: K2.2 ; sheet 60/40m/IN_60_40
NetC64_1: K3.7 ; sheet 60/40m/OUT_60_40
NetC66_1: K3.3 ; sheet 80m/IN_80
NetC69_1: K4.2 ; sheet 80m/OUT_80
NetC71_1: K2.5 ; sheet 160m/IN_160
NetC74_1: K3.4 ; sheet 160m/OUT_160
NetJ9_B2: J9.B2 K1.4
NetJ9_B3: J9.B3 K4.7
NetK1_2: K1.2 K4.5
NetK1_3: K1.3 K1.6 M11.1
NetK1_7: K1.7 K2.6
NetK2_4: K2.4 K3.5
NetK2_7: K2.7 K3.2
NetK3_6: K3.6 K4.4
NetK5_6: M11.2 ; port LPF_IN
NetM12_2: M12.2 ; port LPF_OUT

Not connected (* = marked no-connect by the designer): J9 A1* A2* A3*; U5 10(Y8)* 11(Y9)*

### Layout directives
rule Width Constraint [Pref Width = 30mil    Min Width = 30mil    Max Width = 30mil]: NetK1_2, NetK1_3, NetK1_7, NetK2_4, NetK2_7, NetK3_6, NetK5_6
rule Width Constraint [Pref Width = 20mil    Min Width = 20mil    Max Width = 20mil]: K1A, K1K, K2A, K2K, K3A, K3K, K4A, K4K, NetC43_1

### Notes on the sheet
- 3.6 MHz(-50dB)
- 7 MHz(-50dB)
- 36 MHz(-50dB)
- (near K2) 20.5 MHz(-50dB)
- 10.7 MHz(-50dB)
- Current control bypass
- ACTION
- A3
- A2
- A1
- A0
- Table 2: BCD Decoder truth table
- Y0
- Y1
- Y2
- Y3
- Y4
- Y5
- Y6
- Y7
- K1 Reset
- K1 Set
- K2 Reset
- K3 Reset
- K2 Set
- L
- H
- X
- K4 Reset
- K3 Set
- K4 Set
- Relay
- K1
- 160m
- Table 1: Relay positions and band selection
- R
- 80m
- 60/40m
- S
- 30/20m
- 17-10m
- ToDo: Add Antenna Off
- K2
- K3
- K4
- - band change in steps for each relay, pulse via BAND3(A3)
- Notes:
- - switching occurs because of open/close voltage difference
- - BAND3(A3) is the output enable pin, active LOW
- 4
- Lowpass filters
- Date:
- File:
- Revision:
- Sheet
- of
- Licence:
- (in symbol G6KU-2FY 3DC) R; S

### Library data of the parts
C43-C47 = CAP: Capacitor; QT Order: QCC-00154; Price: 0.068
J9 = 1373826: SMD male connector, nominal current: 2.2 A, Test voltage: 840 VAC, number of positions: 6, pitch: 1.27 mm, color: black, contact surface: Gold, type of contact: Male connector, mounting: SMD soldering; Manufacturer_Name: Phoenix Contact; Geometry.Height: 6.75mm; Mouser Part Number: 651-1373826; Mouser Price/Stock: https://www.mouser.co.uk/ProductDetail/Phoenix-Contact/1373826?qs=2SLPxufLcgB13Clq%252BEBMrA%3D%3D; Manufacturer_Part_Number: 1373826; Datasheet Link: http://www.phoenixcontact.com/gb/produkte/1373826
K1-K4 = G6KU-2FY 3DC: Single-winding Latching Relay; Order: FN 118-1070; Price: 2.19
M11-M17 = RES: Resistor; QT Order: QCR-00268; Price: 0.009
R21-R28 = RES: Resistor; QT Order: QCR-00427; Price: 0.017
U5 = SN74LS145D: BCD DECODER/DRIVER; Price: 1.22

## Sheet rf_lpf_30_20.SchDoc: mcHF Pro Transceiver RF board
size A3; Author: Krassi Atanassov; CompanyName: MØNKA; Engineer: For radio amateurs experimentation, non-commercial use only. Thank you!; Revision: 0.8.2; SheetTotal: 14
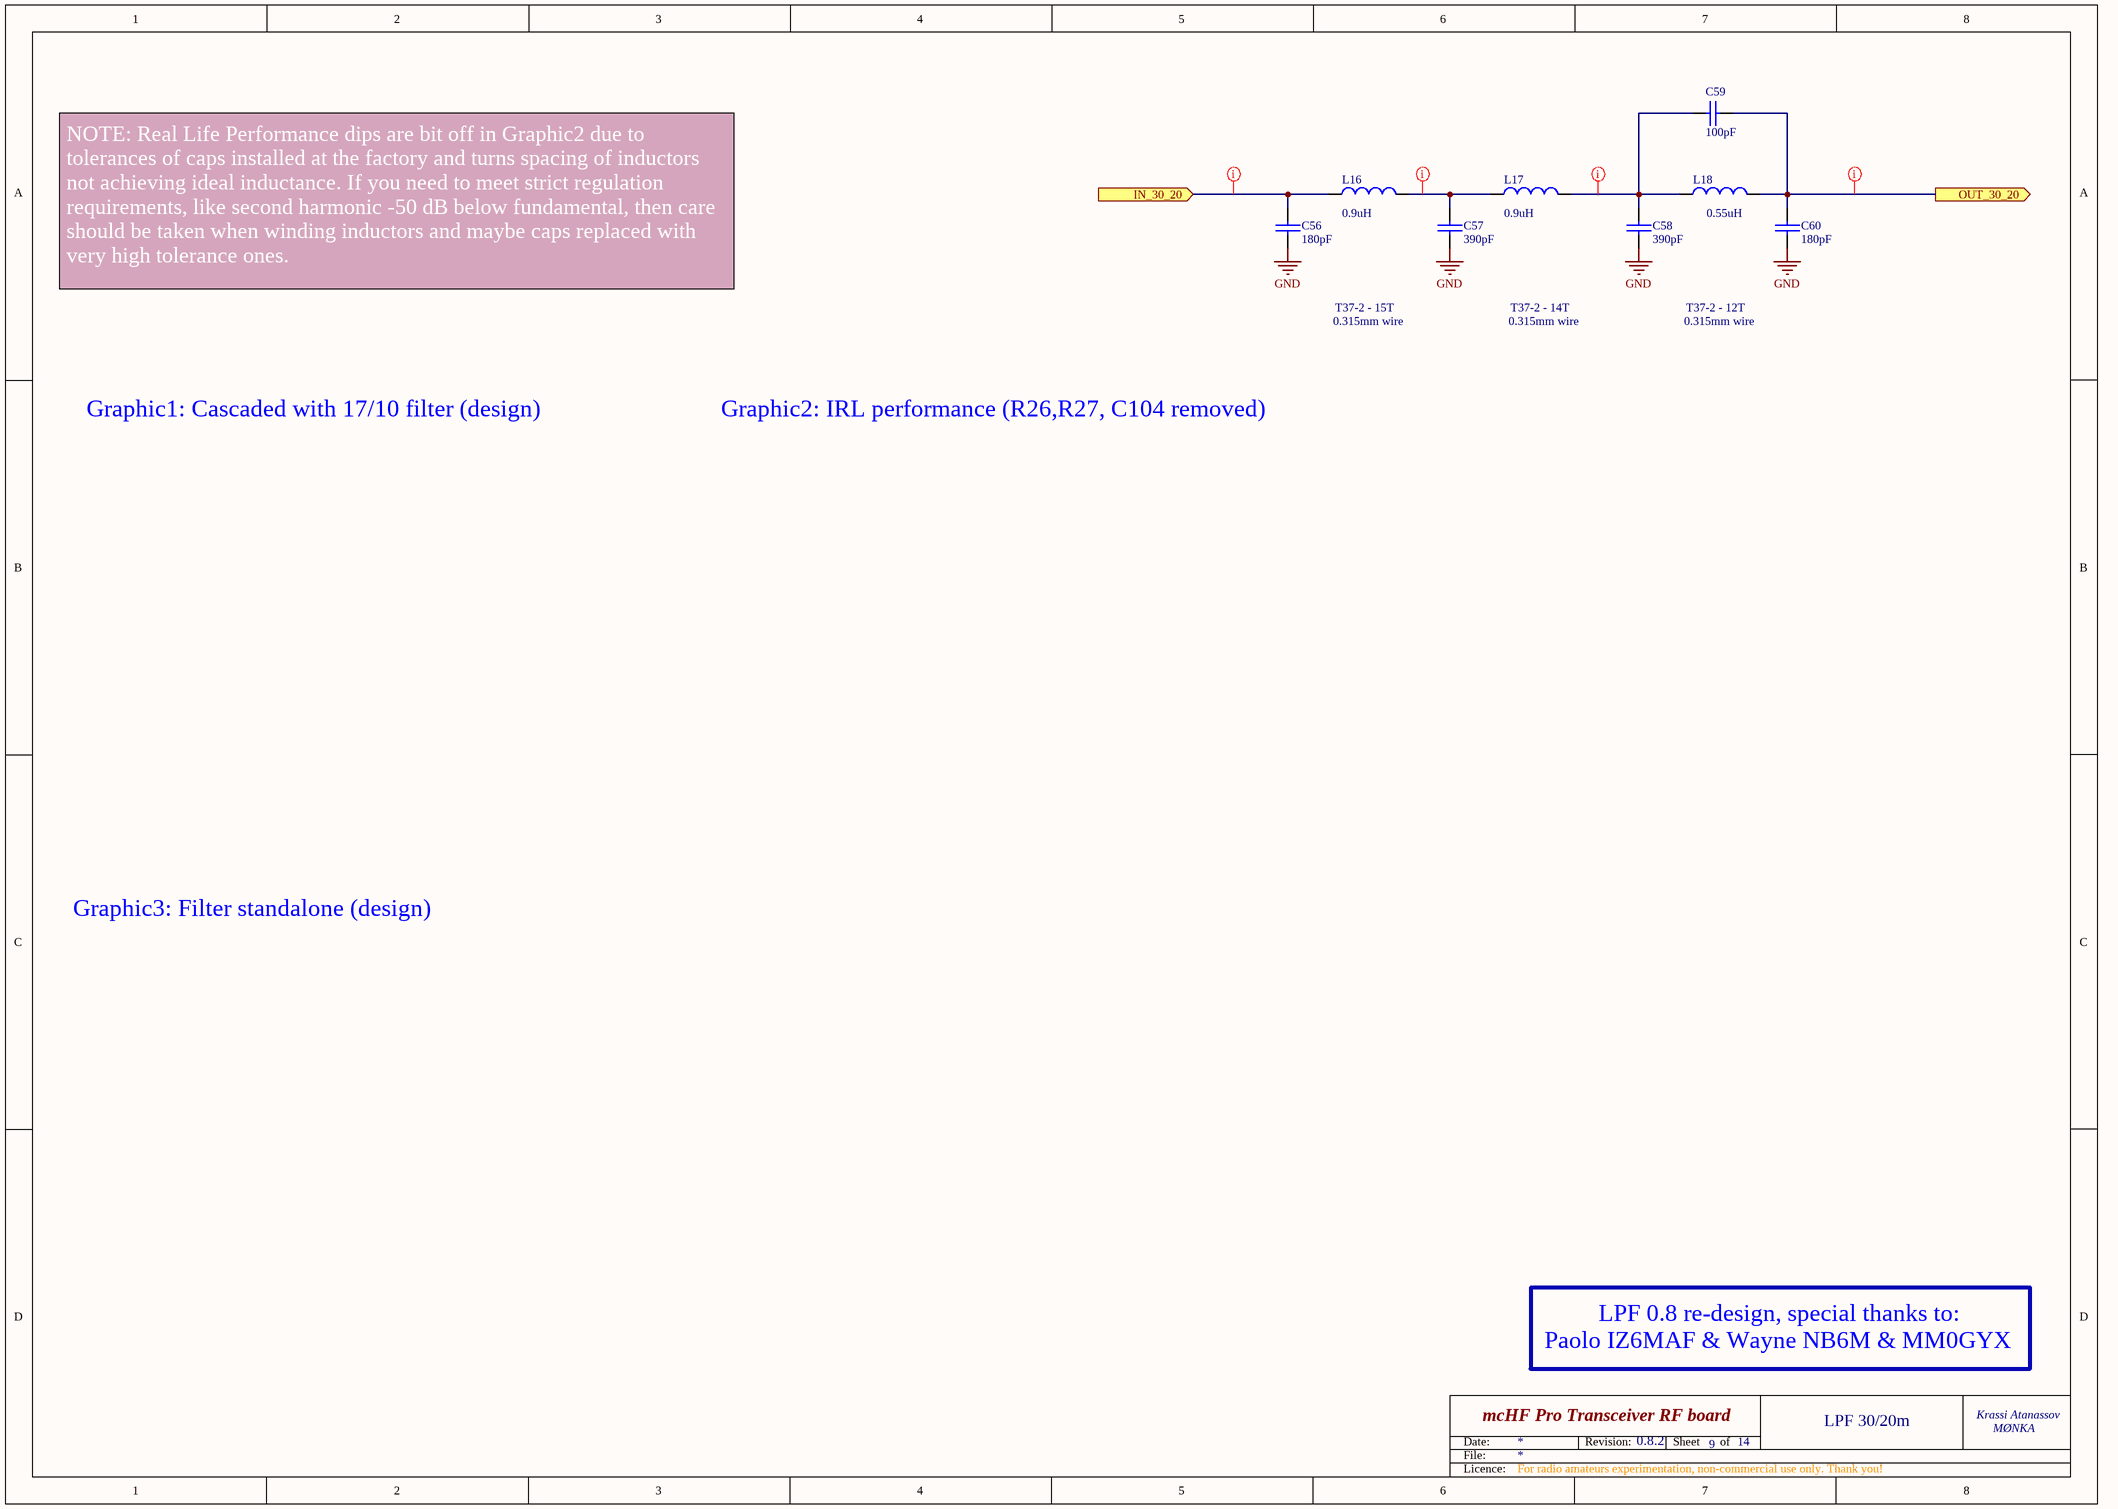
[diagram p4: rf_lpf_30_20.SchDoc]

### Parts
C56  180pF  [0805]
C57  390pF  [0805]
C58  390pF  [0805]
C59  100pF  [0805]
C60  180pF  [0805]
L16  Inductance: 0.9uH  [LPF_IND]  (hidden comment: T37-2)
L17  Inductance: 0.9uH  [LPF_IND]  (hidden comment: T37-2)
L18  Inductance: 0.55uH  [LPF_IND]  (hidden comment: T37-2)

### Ports
IN_30_20 (in), OUT_30_20 (out)

### Nets
GND: C56.1 C57.1 C58.1 C60.1
NetC56_2: C56.2 L16.1 ; port IN_30_20
NetC57_2: C57.2 L16.2 L17.1
NetC58_2: C58.2 C59.2 L17.2 L18.1
NetC59_1: C59.1 C60.2 L18.2 ; port OUT_30_20

### Layout directives
rule Width Constraint [Pref Width = 30mil    Min Width = 30mil    Max Width = 30mil]: NetC56_2, NetC57_2, NetC58_2, NetC59_1

### Notes on the sheet
- NOTE: Real Life Performance dips are bit off in Graphic2 due to tolerances of caps installed at the factory and turns spacing of inductors not achieving ideal inductance. If you need to meet strict regulation requirements, like second harmonic -50 dB below fundamental, then care should be taken when winding inductors and maybe caps replaced with very high tolerance ones.
- T37-2 - 15T
- T37-2 - 14T
- T37-2 - 12T
- 0.315mm wire
- Graphic1: Cascaded with 17/10 filter (design)
- Graphic2: IRL performance (R26,R27, C104 removed)
- Graphic3: Filter standalone (design)
- LPF 0.8 re-design, special thanks to:
- Paolo IZ6MAF & Wayne NB6M & MM0GYX
- 6
- LPF 30/20m
- Date:
- File:
- Revision:
- Sheet
- of
- Licence:

### Library data of the parts
C56-C60 = CAP: Capacitor; Notes: COG/NPO; Voltage: 100V
L16-L18 = LPF_IND: T37-2 handwound inductor; Notes: post assembly; Price: 0.20

## Sheet rf_lpf_60_40.SchDoc: mcHF Pro Transceiver RF board
size A3; Author: Krassi Atanassov; CompanyName: MØNKA; Engineer: For radio amateurs experimentation, non-commercial use only. Thank you!; Revision: 0.8.2; SheetTotal: 14
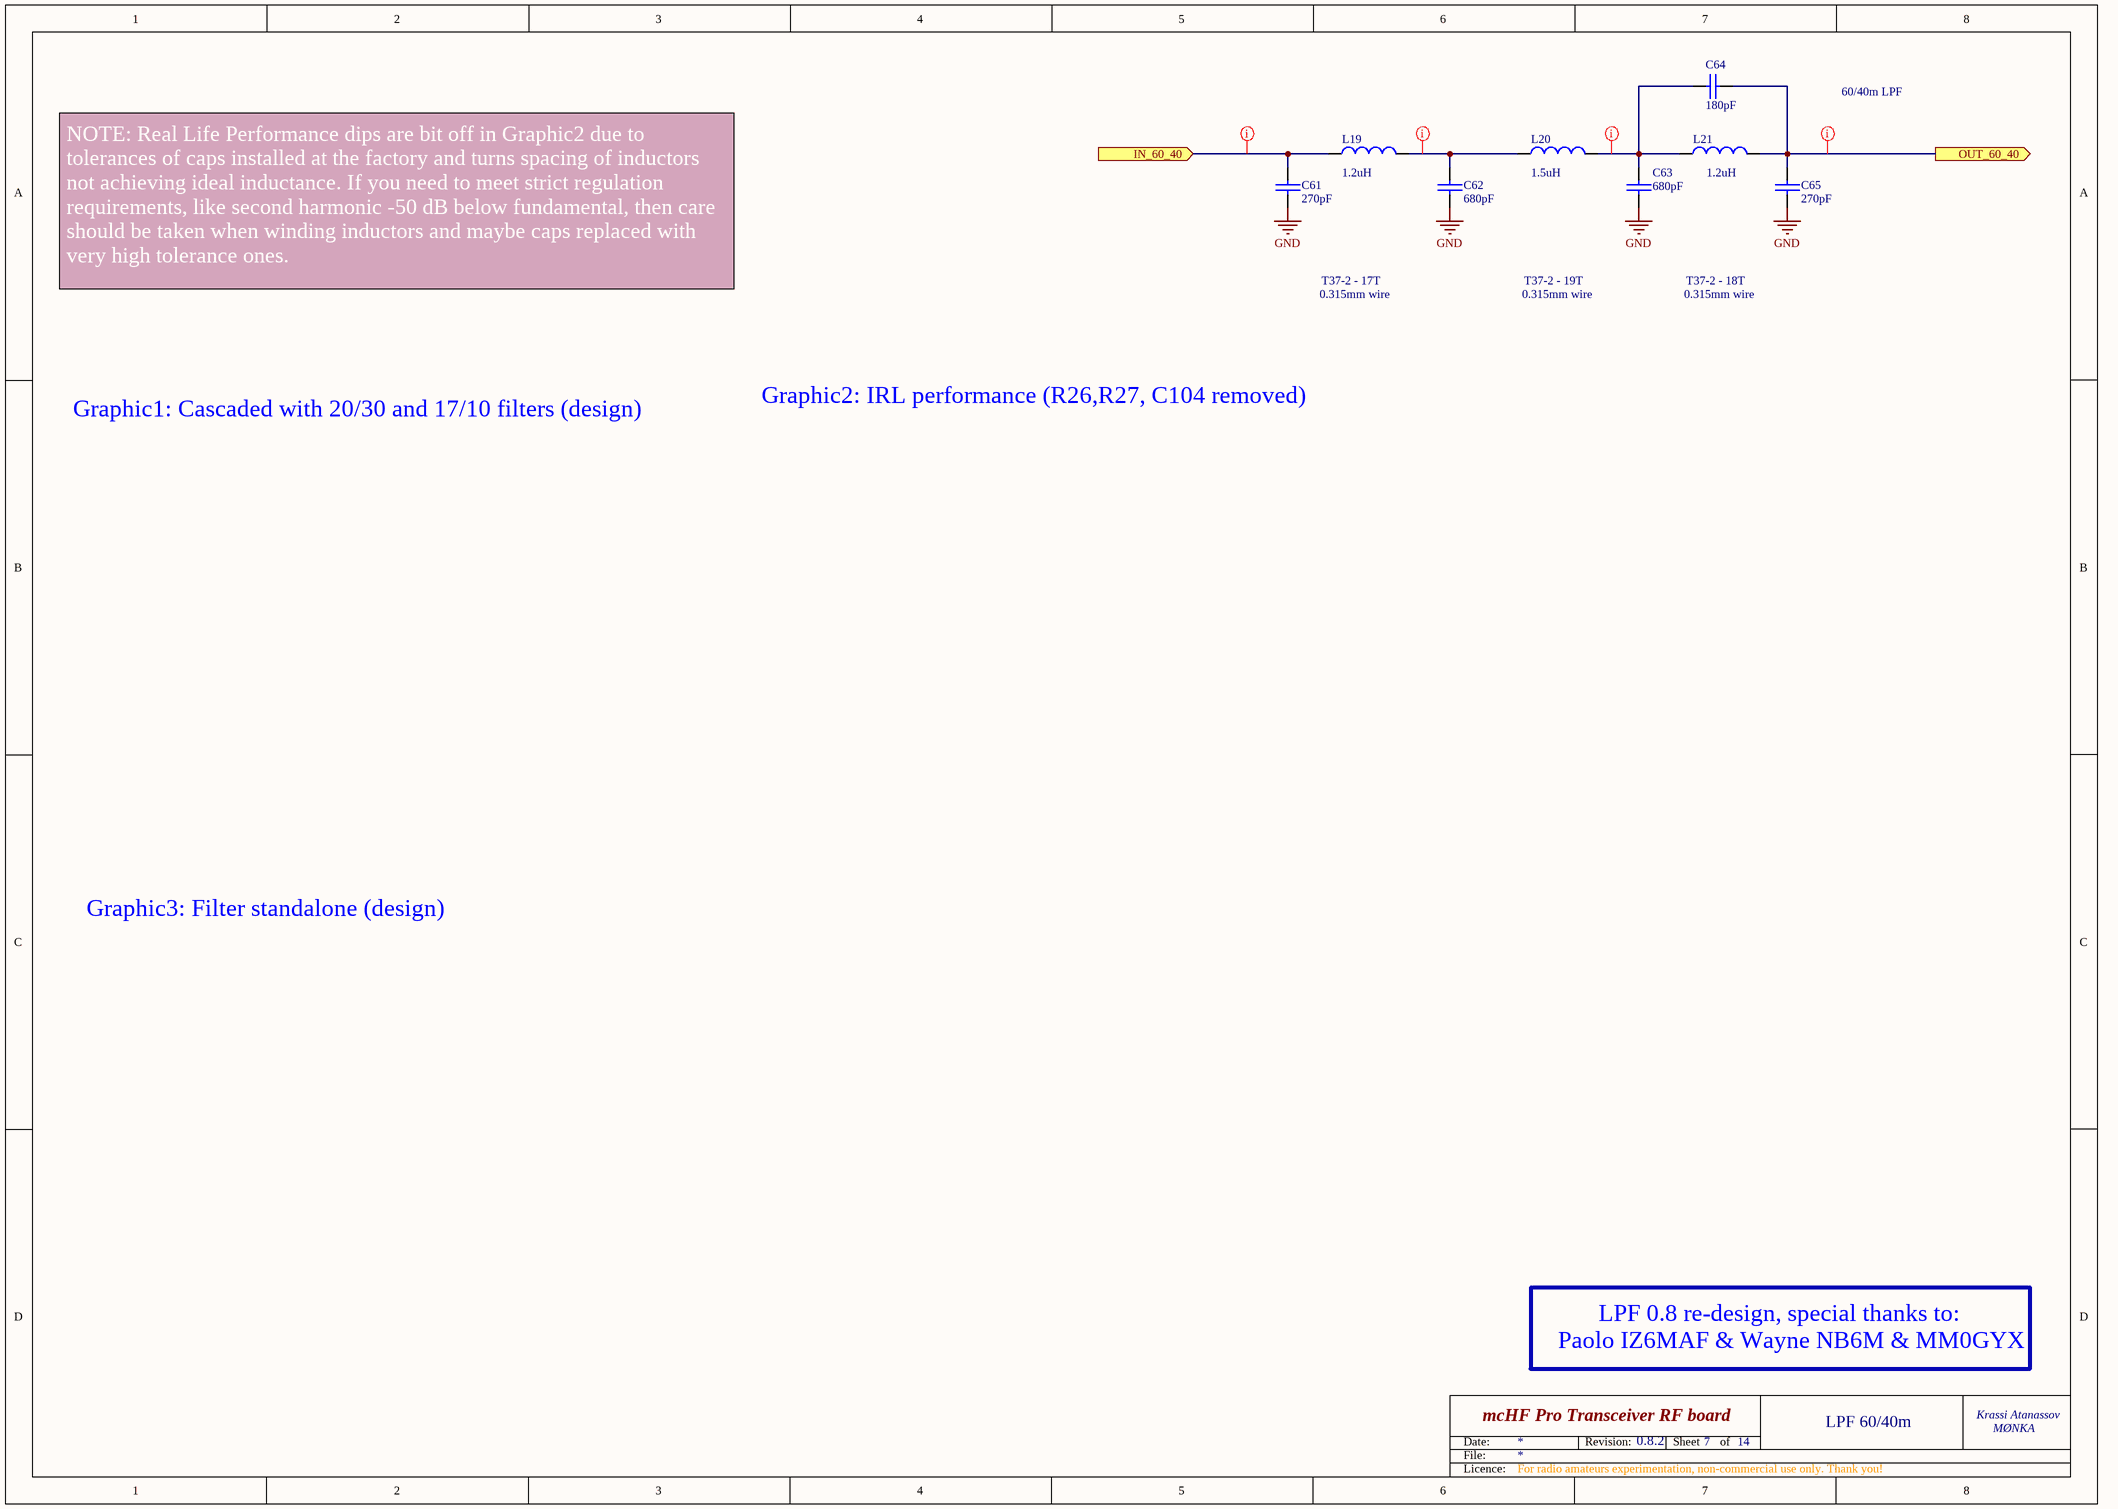
[diagram p5: rf_lpf_60_40.SchDoc]

### Parts
C61  270pF  [0805]
C62  680pF  [0805]
C63  680pF  [0805]
C64  180pF  [0805]
C65  270pF  [0805]
L19  Inductance: 1.2uH  [LPF_IND]  (hidden comment: T37-2)
L20  Inductance: 1.5uH  [LPF_IND]  (hidden comment: T37-2)
L21  Inductance: 1.2uH  [LPF_IND]  (hidden comment: T37-2)

### Ports
IN_60_40 (in), OUT_60_40 (out)

### Nets
GND: C61.1 C62.1 C63.1 C65.1
NetC61_2: C61.2 L19.1 ; port IN_60_40
NetC62_2: C62.2 L19.2 L20.1
NetC63_2: C63.2 C64.2 L20.2 L21.1
NetC64_1: C64.1 C65.2 L21.2 ; port OUT_60_40

### Layout directives
rule Width Constraint [Pref Width = 30mil    Min Width = 30mil    Max Width = 30mil]: NetC61_2, NetC62_2, NetC63_2, NetC64_1

### Notes on the sheet
- 60/40m LPF
- NOTE: Real Life Performance dips are bit off in Graphic2 due to tolerances of caps installed at the factory and turns spacing of inductors not achieving ideal inductance. If you need to meet strict regulation requirements, like second harmonic -50 dB below fundamental, then care should be taken when winding inductors and maybe caps replaced with very high tolerance ones.
- T37-2 - 17T
- 0.315mm wire
- T37-2 - 19T
- T37-2 - 18T
- Graphic1: Cascaded with 20/30 and 17/10 filters (design)
- Graphic2: IRL performance (R26,R27, C104 removed)
- Graphic3: Filter standalone (design)
- LPF 0.8 re-design, special thanks to:
- Paolo IZ6MAF & Wayne NB6M & MM0GYX
- 7
- LPF 60/40m
- Date:
- File:
- Revision:
- Sheet
- of
- Licence:

### Library data of the parts
C61-C65 = CAP: Capacitor; Notes: COG/NPO; Voltage: 100V
L19-L21 = LPF_IND: as L16 on sheet rf_lpf_30_20; Price: 0.20

## Sheet rf_lpf_80.SchDoc: mcHF Pro Transceiver RF board
size A3; Author: Krassi Atanassov; CompanyName: MØNKA; Engineer: For radio amateurs experimentation, non-commercial use only. Thank you!; Revision: 0.8.2; SheetTotal: 14
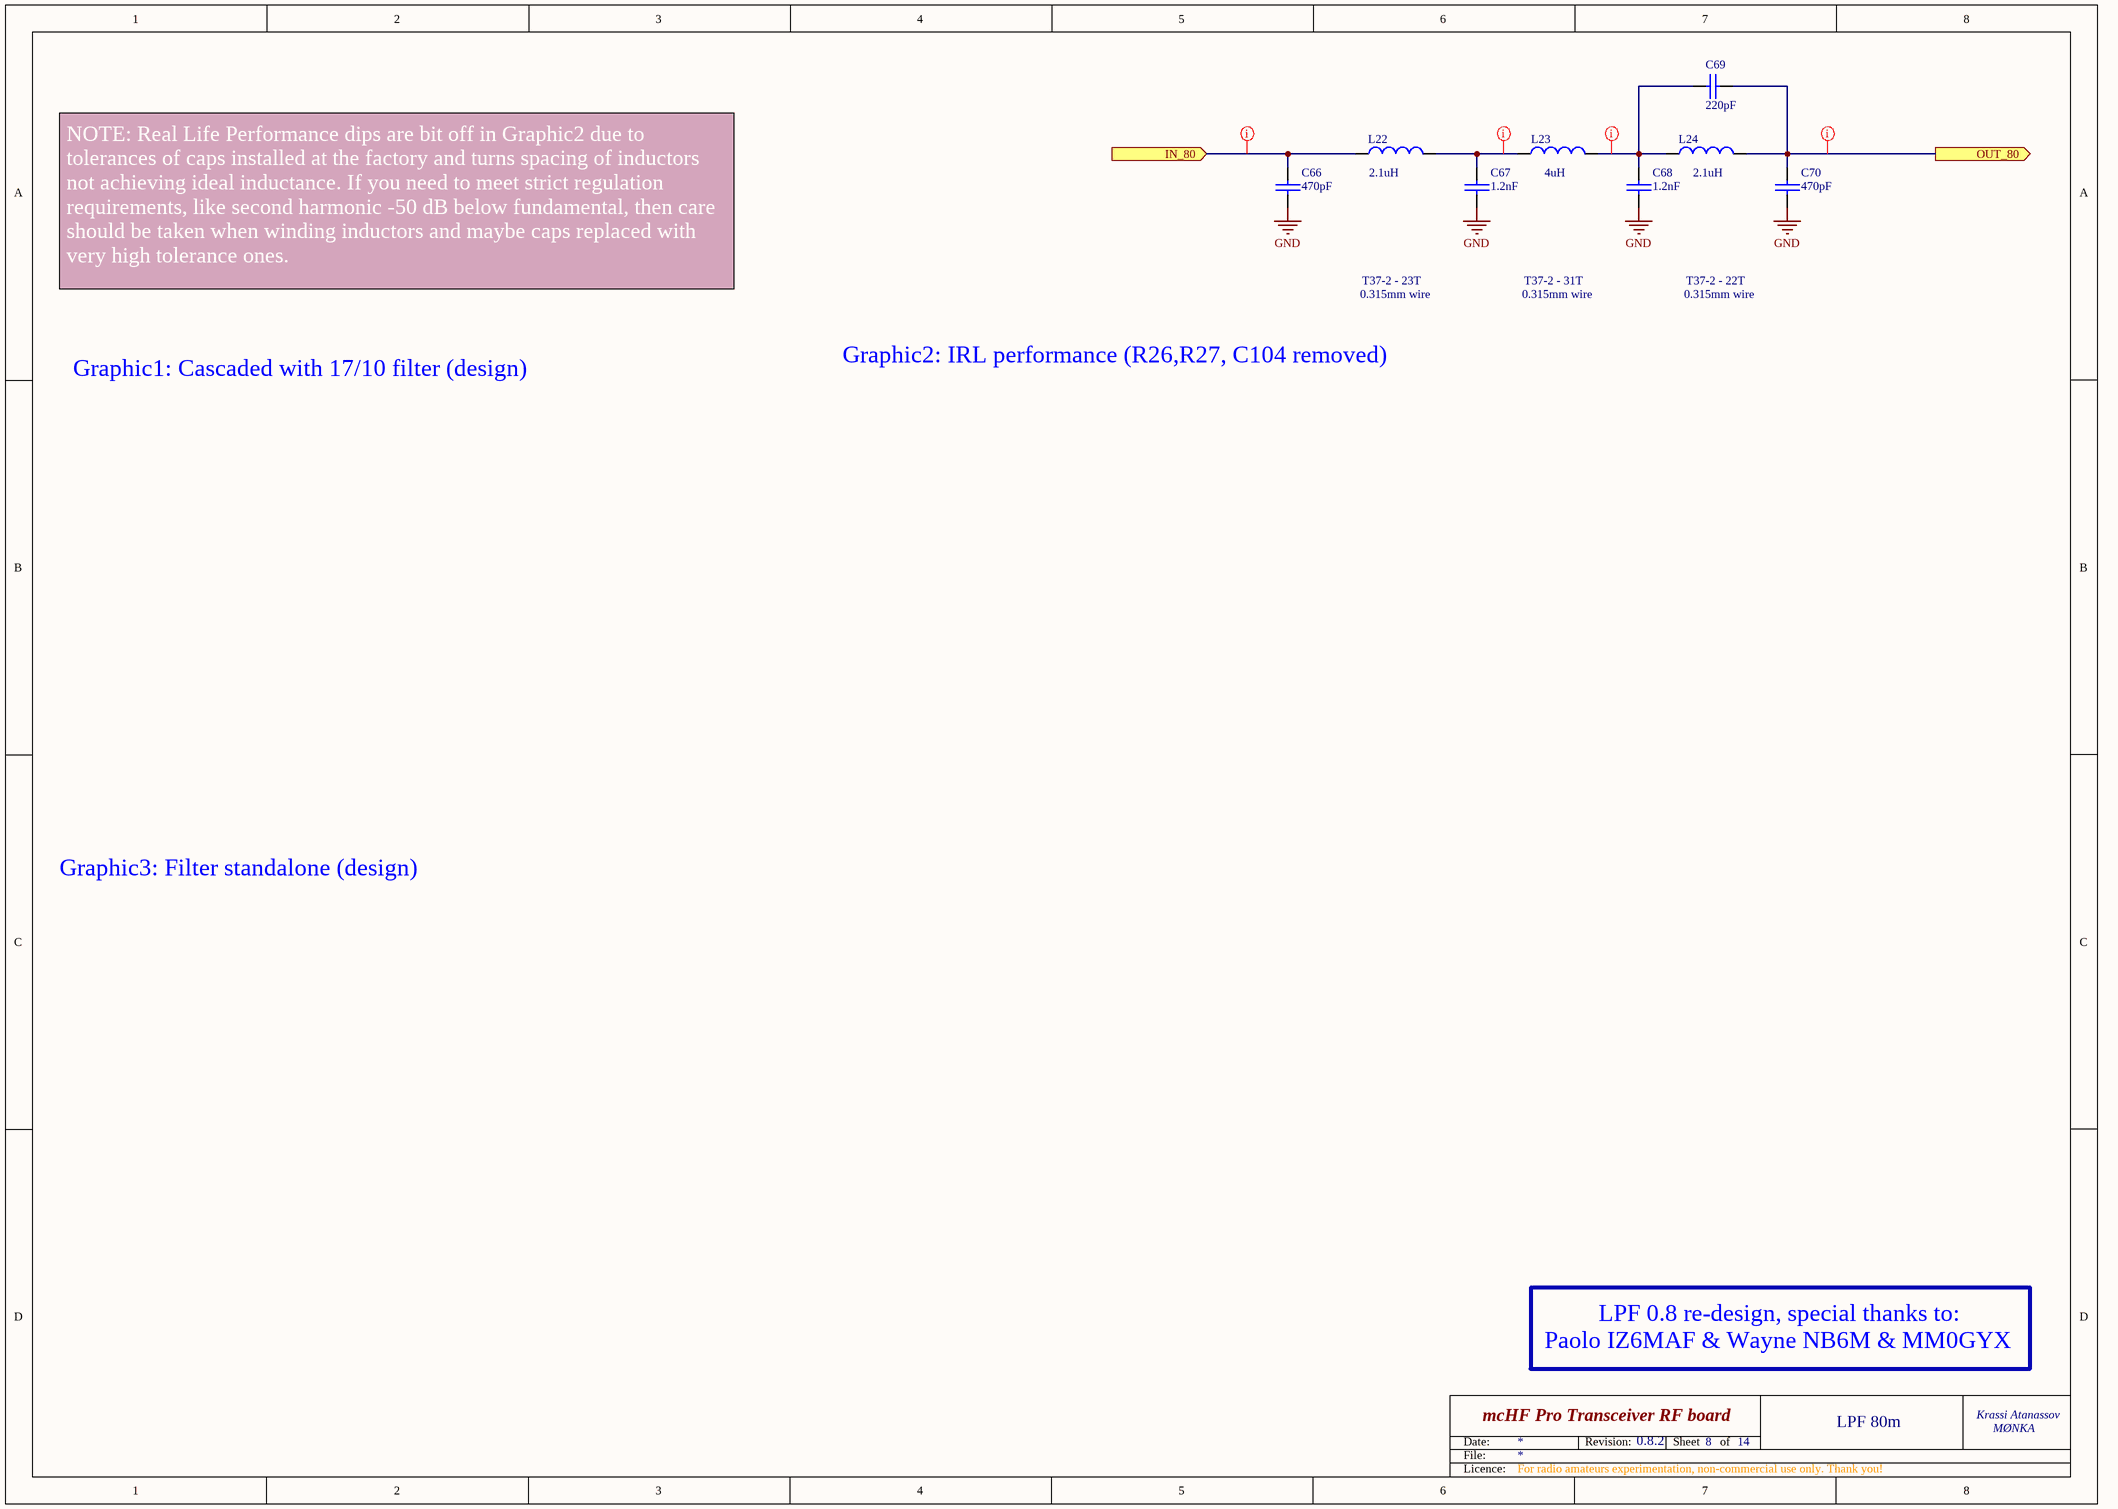
[diagram p6: rf_lpf_80.SchDoc]

### Parts
C66  470pF  [0805]
C67  1.2nF  [0805]
C68  1.2nF  [0805]
C69  220pF  [0805]
C70  470pF  [0805]
L22  Inductance: 2.1uH  [LPF_IND]  (hidden comment: T37-2)
L23  Inductance: 4uH  [LPF_IND]  (hidden comment: T37-2)
L24  Inductance: 2.1uH  [LPF_IND]  (hidden comment: T37-2)

### Ports
IN_80 (in), OUT_80 (out)

### Nets
GND: C66.2 C67.2 C68.2 C70.2
NetC66_1: C66.1 L22.1 ; port IN_80
NetC67_1: C67.1 L22.2 L23.1
NetC68_1: C68.1 C69.2 L23.2 L24.1
NetC69_1: C69.1 C70.1 L24.2 ; port OUT_80

### Layout directives
rule Width Constraint [Pref Width = 30mil    Min Width = 30mil    Max Width = 30mil]: NetC66_1, NetC67_1, NetC68_1, NetC69_1

### Notes on the sheet
- NOTE: Real Life Performance dips are bit off in Graphic2 due to tolerances of caps installed at the factory and turns spacing of inductors not achieving ideal inductance. If you need to meet strict regulation requirements, like second harmonic -50 dB below fundamental, then care should be taken when winding inductors and maybe caps replaced with very high tolerance ones.
- T37-2 - 23T
- 0.315mm wire
- T37-2 - 31T
- T37-2 - 22T
- Graphic1: Cascaded with 17/10 filter (design)
- Graphic2: IRL performance (R26,R27, C104 removed)
- Graphic3: Filter standalone (design)
- LPF 0.8 re-design, special thanks to:
- Paolo IZ6MAF & Wayne NB6M & MM0GYX
- 8
- LPF 80m
- Date:
- File:
- Revision:
- Sheet
- of
- Licence:

### Library data of the parts
C66 C70 = CAP: Capacitor; QT Order: QCC-00460; Notes: COG/NPO; Voltage: 100V; Price: 0.063
C67 C68 = CAP: Capacitor; QT Order: QCC-00142; Notes: COG/NPO; Voltage: 100V; Price: 0.143
C69 = CAP: Capacitor; Notes: COG/NPO; Voltage: 100V; Price: 0.068
L22-L24 = LPF_IND: as L16 on sheet rf_lpf_30_20; Price: 0.20

## Sheet rf_lpf_160.SchDoc: mcHF Pro Transceiver RF board
size A3; Author: Krassi Atanassov; CompanyName: MØNKA; Engineer: For radio amateurs experimentation, non-commercial use only. Thank you!; Revision: 0.8.5; SheetTotal: 14
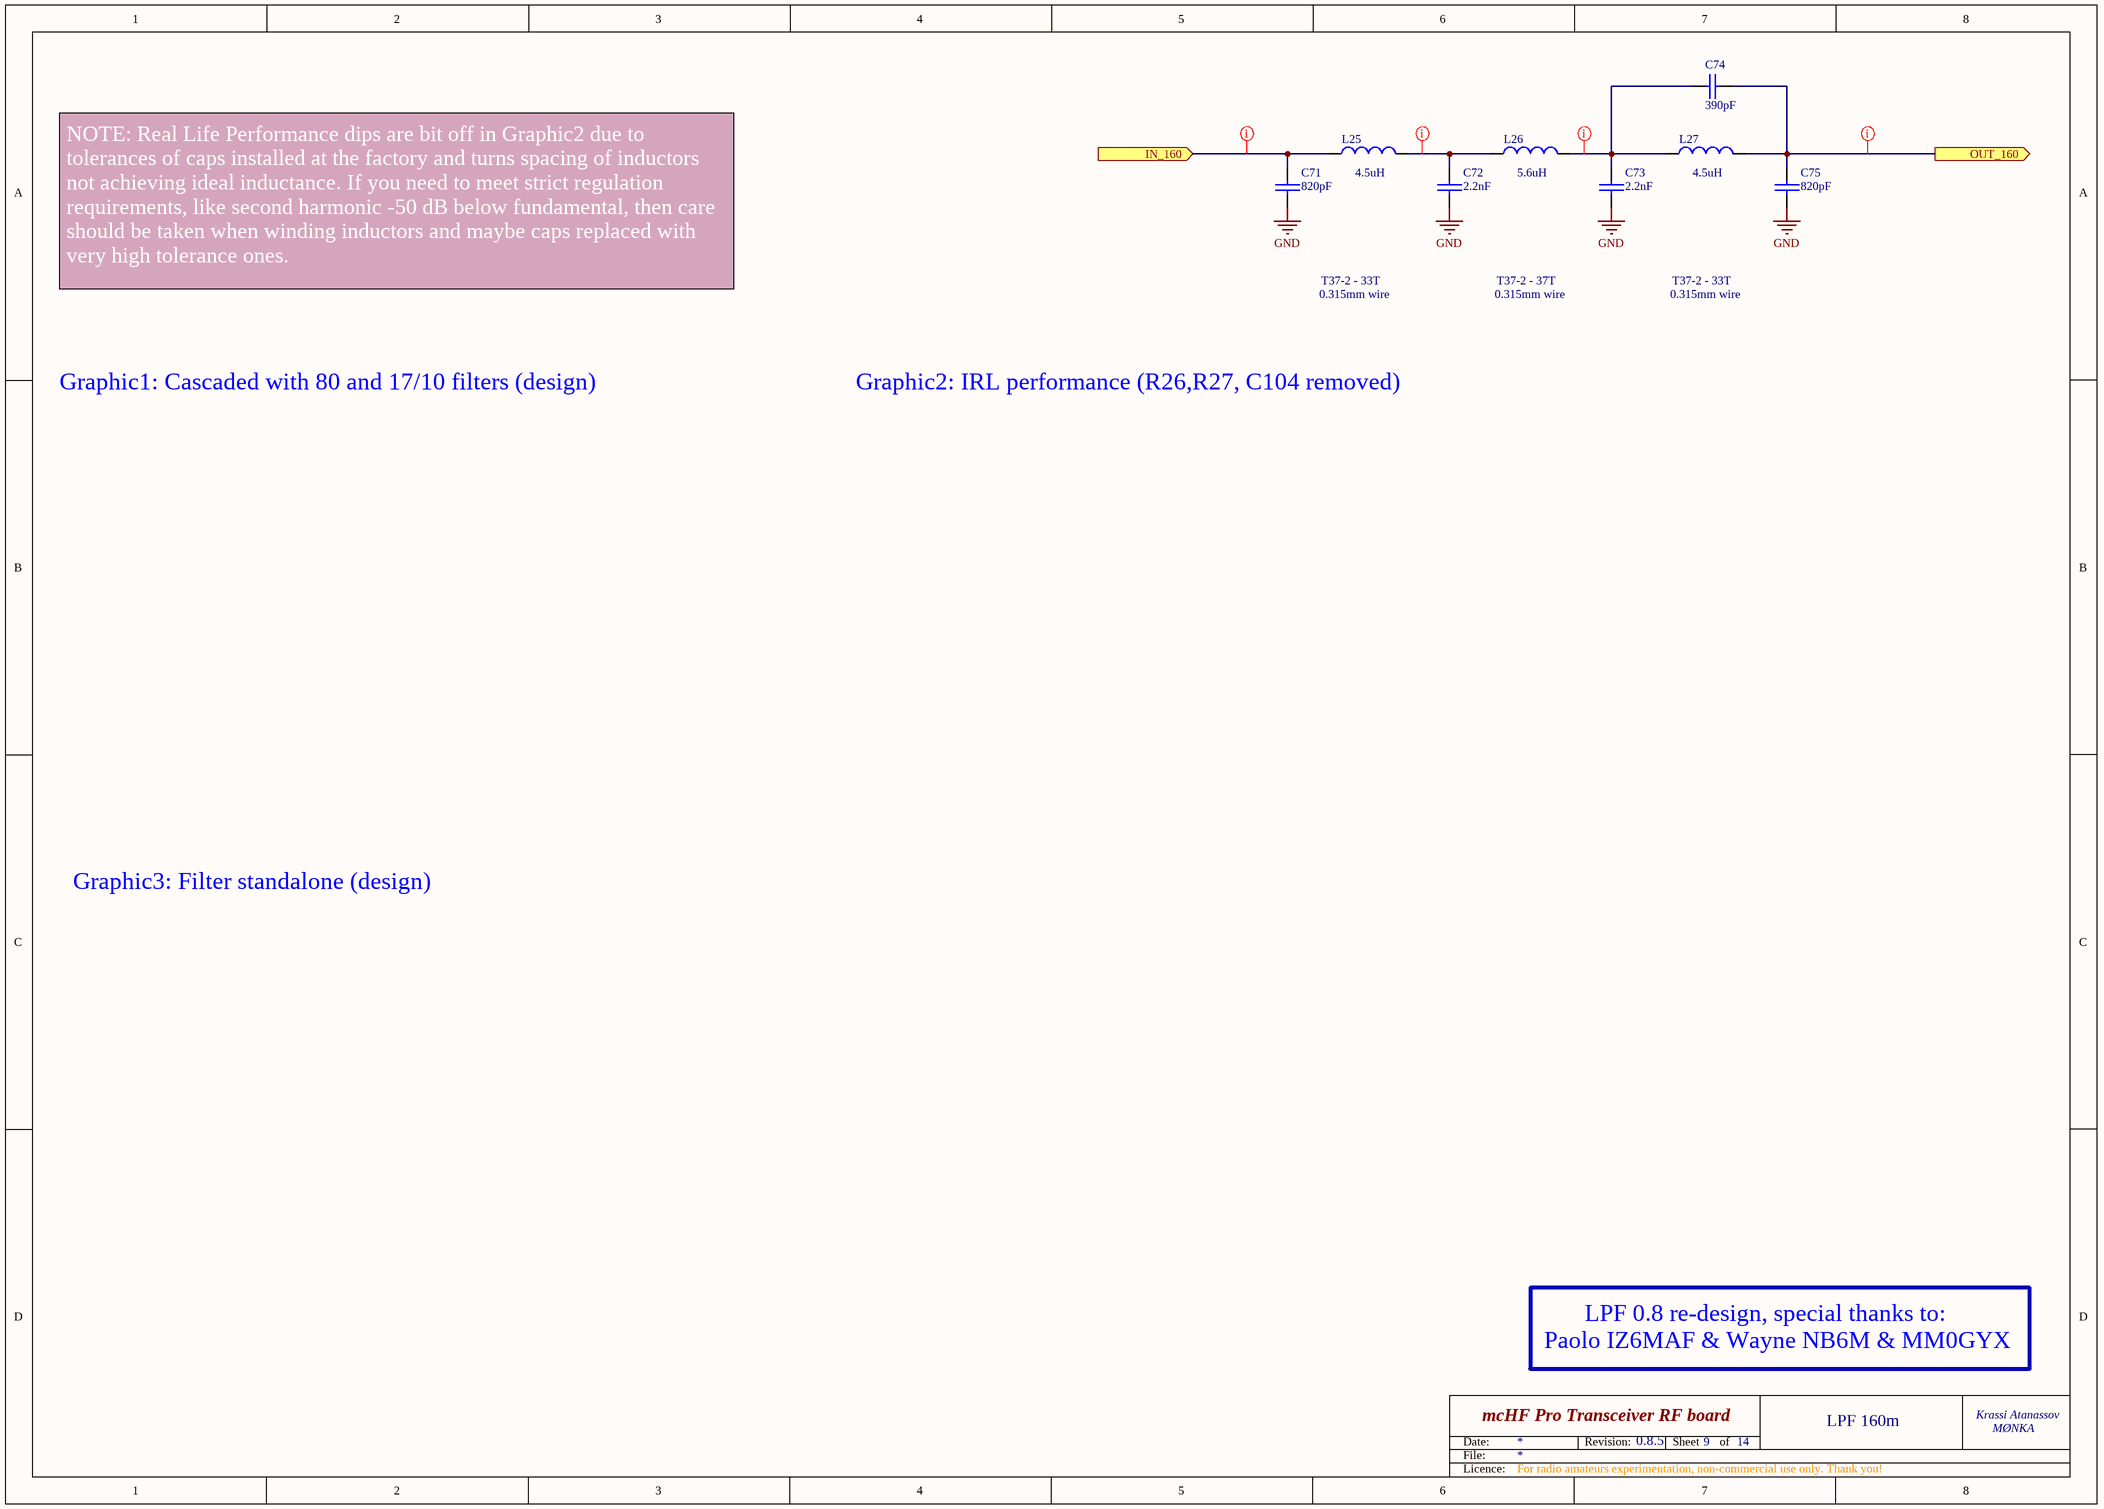
[diagram p7: rf_lpf_160.SchDoc]

### Parts
C71  820pF  [0805]
C72  2.2nF  [0805]
C73  2.2nF  [0805]
C74  390pF  [0805]
C75  820pF  [0805]
L25  Inductance: 4.5uH  [LPF_IND]  (hidden comment: T37-2)
L26  Inductance: 5.6uH  [LPF_IND]  (hidden comment: T37-2)
L27  Inductance: 4.5uH  [LPF_IND]  (hidden comment: T37-2)

### Ports
IN_160 (in), OUT_160 (out)

### Nets
GND: C71.2 C72.2 C73.2 C75.2
NetC71_1: C71.1 L25.1 ; port IN_160
NetC72_1: C72.1 L25.2 L26.1
NetC73_1: C73.1 C74.2 L26.2 L27.1
NetC74_1: C74.1 C75.1 L27.2 ; port OUT_160

### Layout directives
rule Width Constraint [Pref Width = 30mil    Min Width = 30mil    Max Width = 30mil]: NetC71_1, NetC72_1, NetC73_1, NetC74_1

### Notes on the sheet
- NOTE: Real Life Performance dips are bit off in Graphic2 due to tolerances of caps installed at the factory and turns spacing of inductors not achieving ideal inductance. If you need to meet strict regulation requirements, like second harmonic -50 dB below fundamental, then care should be taken when winding inductors and maybe caps replaced with very high tolerance ones.
- T37-2 - 33T
- 0.315mm wire
- T37-2 - 37T
- Graphic1: Cascaded with 80 and 17/10 filters (design)
- Graphic2: IRL performance (R26,R27, C104 removed)
- Graphic3: Filter standalone (design)
- LPF 0.8 re-design, special thanks to:
- Paolo IZ6MAF & Wayne NB6M & MM0GYX
- 9
- LPF 160m
- Date:
- File:
- Revision:
- Sheet
- of
- Licence:

### Library data of the parts
C71-C73 C75 = CAP: Capacitor; Notes: COG/NPO; Voltage: 100V
C74 = CAP: Capacitor; QT Order: QCC-00125; Notes: COG/NPO; Voltage: 100V; Price: 0.078
L25-L27 = LPF_IND: as L16 on sheet rf_lpf_30_20; Price: 0.20

## Sheet rf_lpf_17_10.SchDoc: mcHF Pro Transceiver RF board
size A3; Author: Krassi Atanassov; CompanyName: MØNKA; Engineer: For radio amateurs experimentation, non-commercial use only. Thank you!; Revision: 0.8.2; SheetTotal: 14
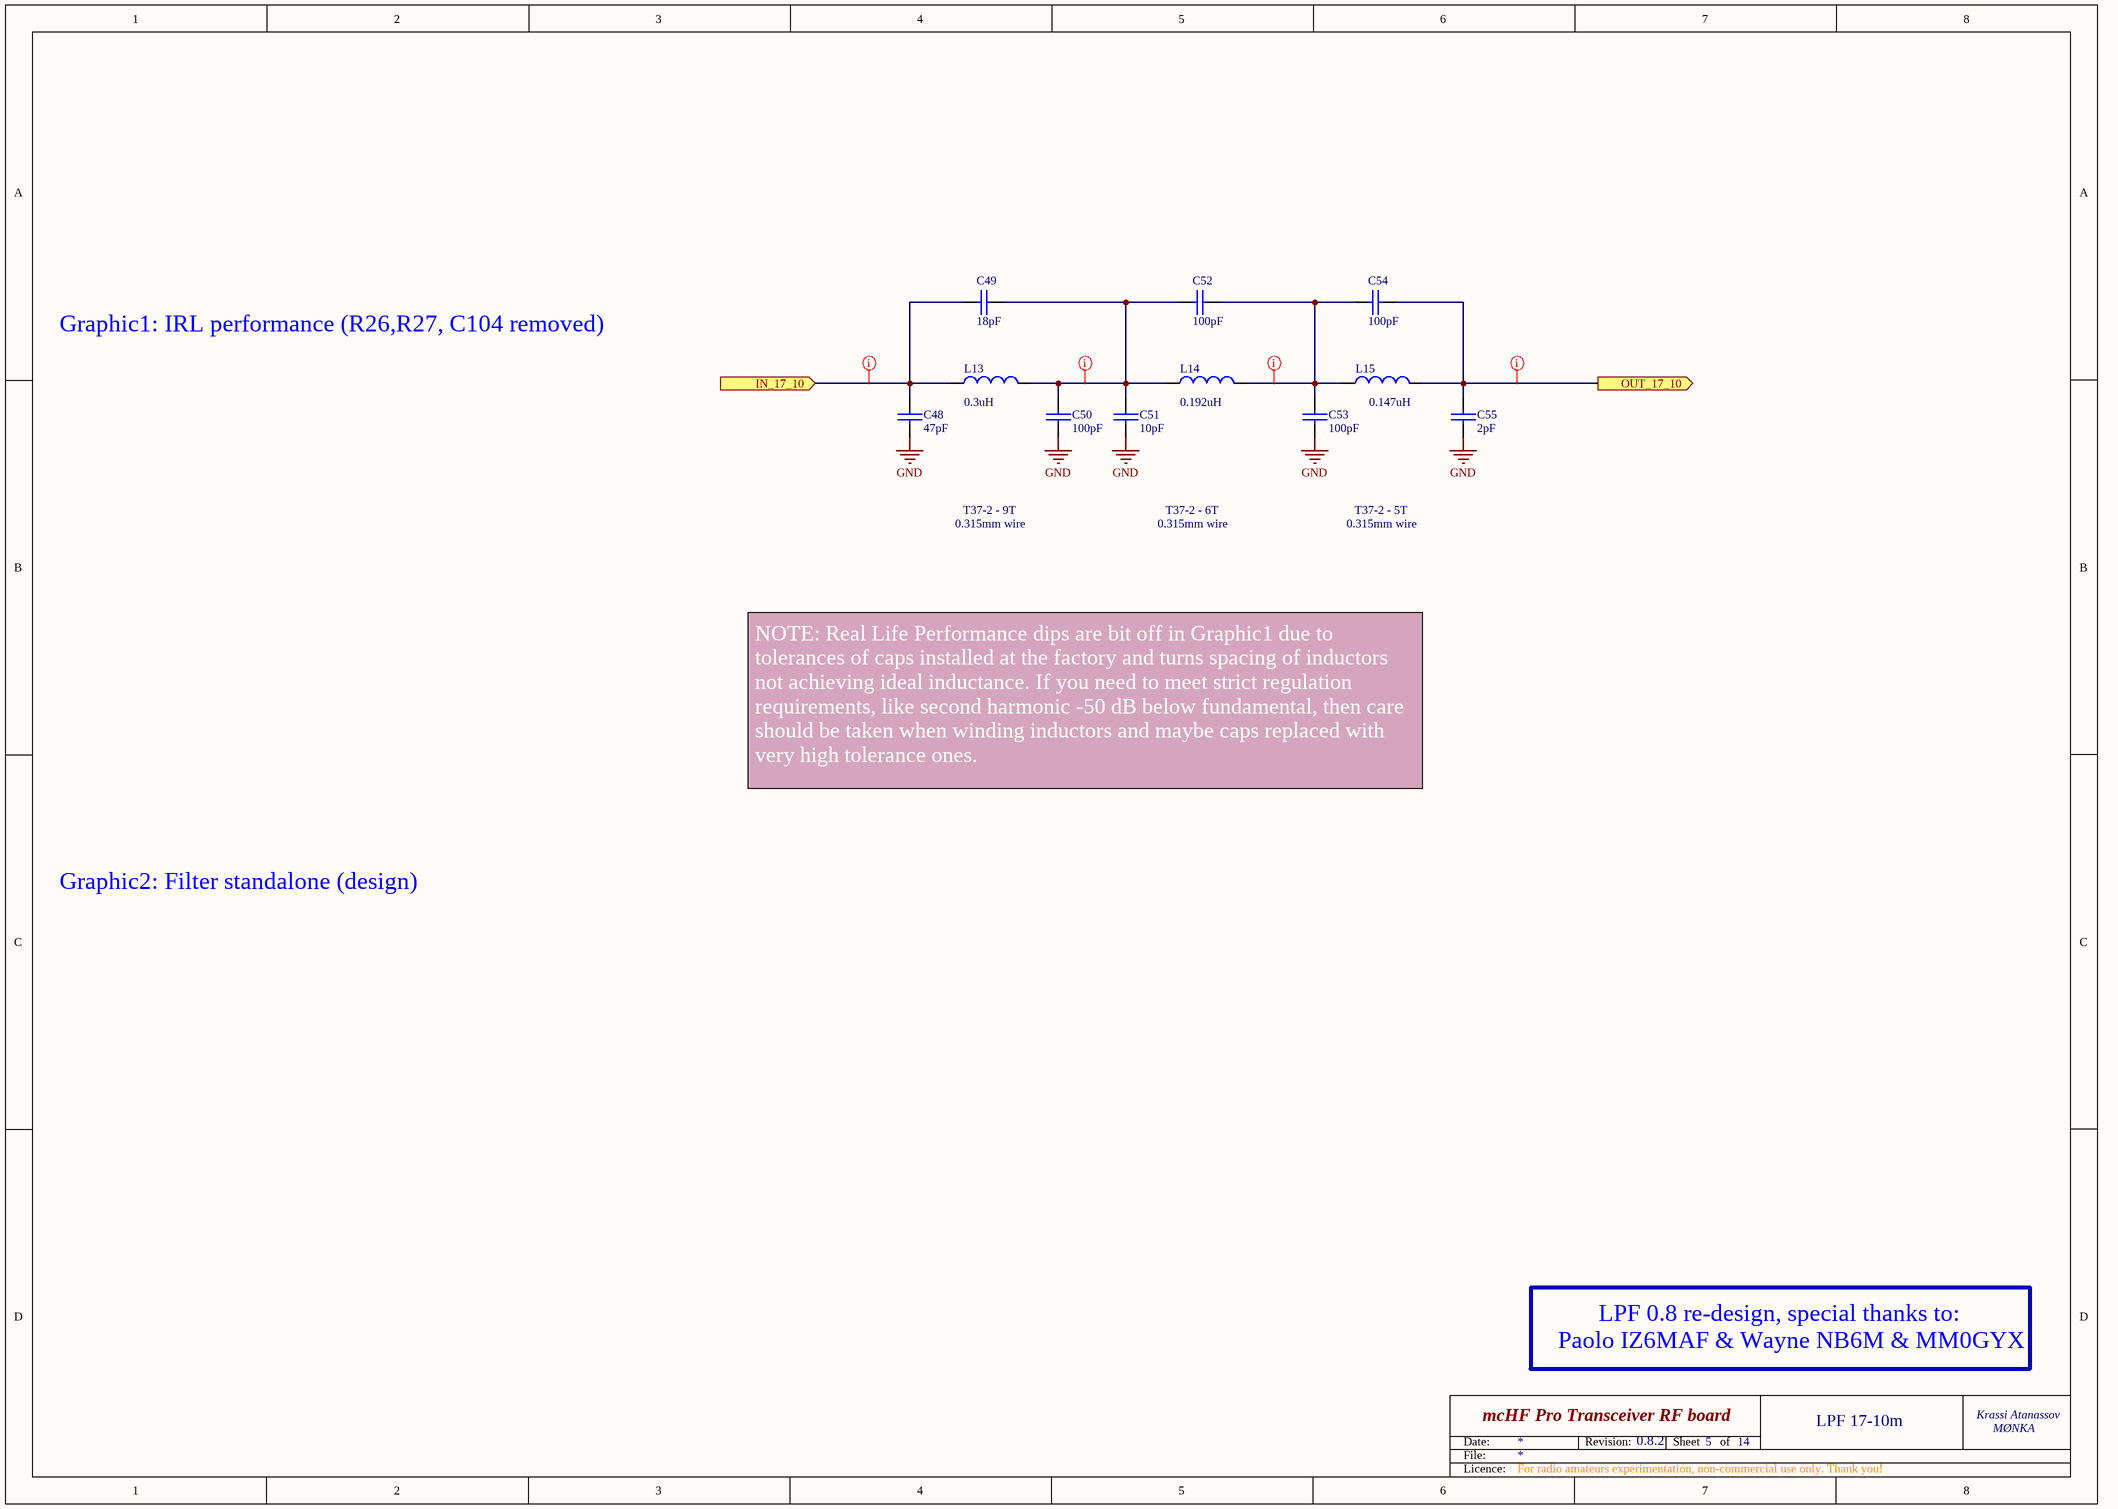
[diagram p8: rf_lpf_17_10.SchDoc]

### Parts
C48  47pF  [0805]
C49  18pF  [0805]
C50  100pF  [0805]
C51  10pF  [0805]
C52  100pF  [0805]
C53  100pF  [0805]
C54  100pF  [0805]
C55  2pF  [0805]
L13  Inductance: 0.3uH  [LPF_IND]  (hidden comment: T37-2)
L14  Inductance: 0.192uH  [LPF_IND]  (hidden comment: T37-2)
L15  Inductance: 0.147uH  [LPF_IND]  (hidden comment: T37-2)

### Ports
IN_17_10 (in), OUT_17_10 (out)

### Nets
GND: C48.1 C50.1 C51.1 C53.1 C55.1
NetC48_2: C48.2 C49.2 L13.1 ; port IN_17_10
NetC49_1: C49.1 C50.2 C51.2 C52.2 L13.2 L14.1
NetC52_1: C52.1 C53.2 C54.2 L14.2 L15.1
NetC54_1: C54.1 C55.2 L15.2 ; port OUT_17_10

### Layout directives
rule Width Constraint [Pref Width = 30mil    Min Width = 30mil    Max Width = 30mil]: NetC48_2, NetC49_1, NetC52_1, NetC54_1

### Notes on the sheet
- Graphic1: IRL performance (R26,R27, C104 removed)
- T37-2 - 9T
- T37-2 - 6T
- T37-2 - 5T
- 0.315mm wire
- NOTE: Real Life Performance dips are bit off in Graphic1 due to tolerances of caps installed at the factory and turns spacing of inductors not achieving ideal inductance. If you need to meet strict regulation requirements, like second harmonic -50 dB below fundamental, then care should be taken when winding inductors and maybe caps replaced with very high tolerance ones.
- Graphic2: Filter standalone (design)
- LPF 0.8 re-design, special thanks to:
- Paolo IZ6MAF & Wayne NB6M & MM0GYX
- 5
- LPF 17-10m
- Date:
- File:
- Revision:
- Sheet
- of
- Licence:

### Library data of the parts
C48-C55 = CAP: Capacitor; Notes: COG/NPO; Voltage: 100V
L13-L15 = LPF_IND: as L16 on sheet rf_lpf_30_20; Price: 0.20

## Sheet rf_conn.SchDoc: mcHF Pro Transceiver RF board
size A3; Author: Krassi Atanassov; CompanyName: MØNKA; Engineer: For radio amateurs experimentation, non-commercial use only. Thank you!; Revision: 0.8.5; SheetTotal: 14
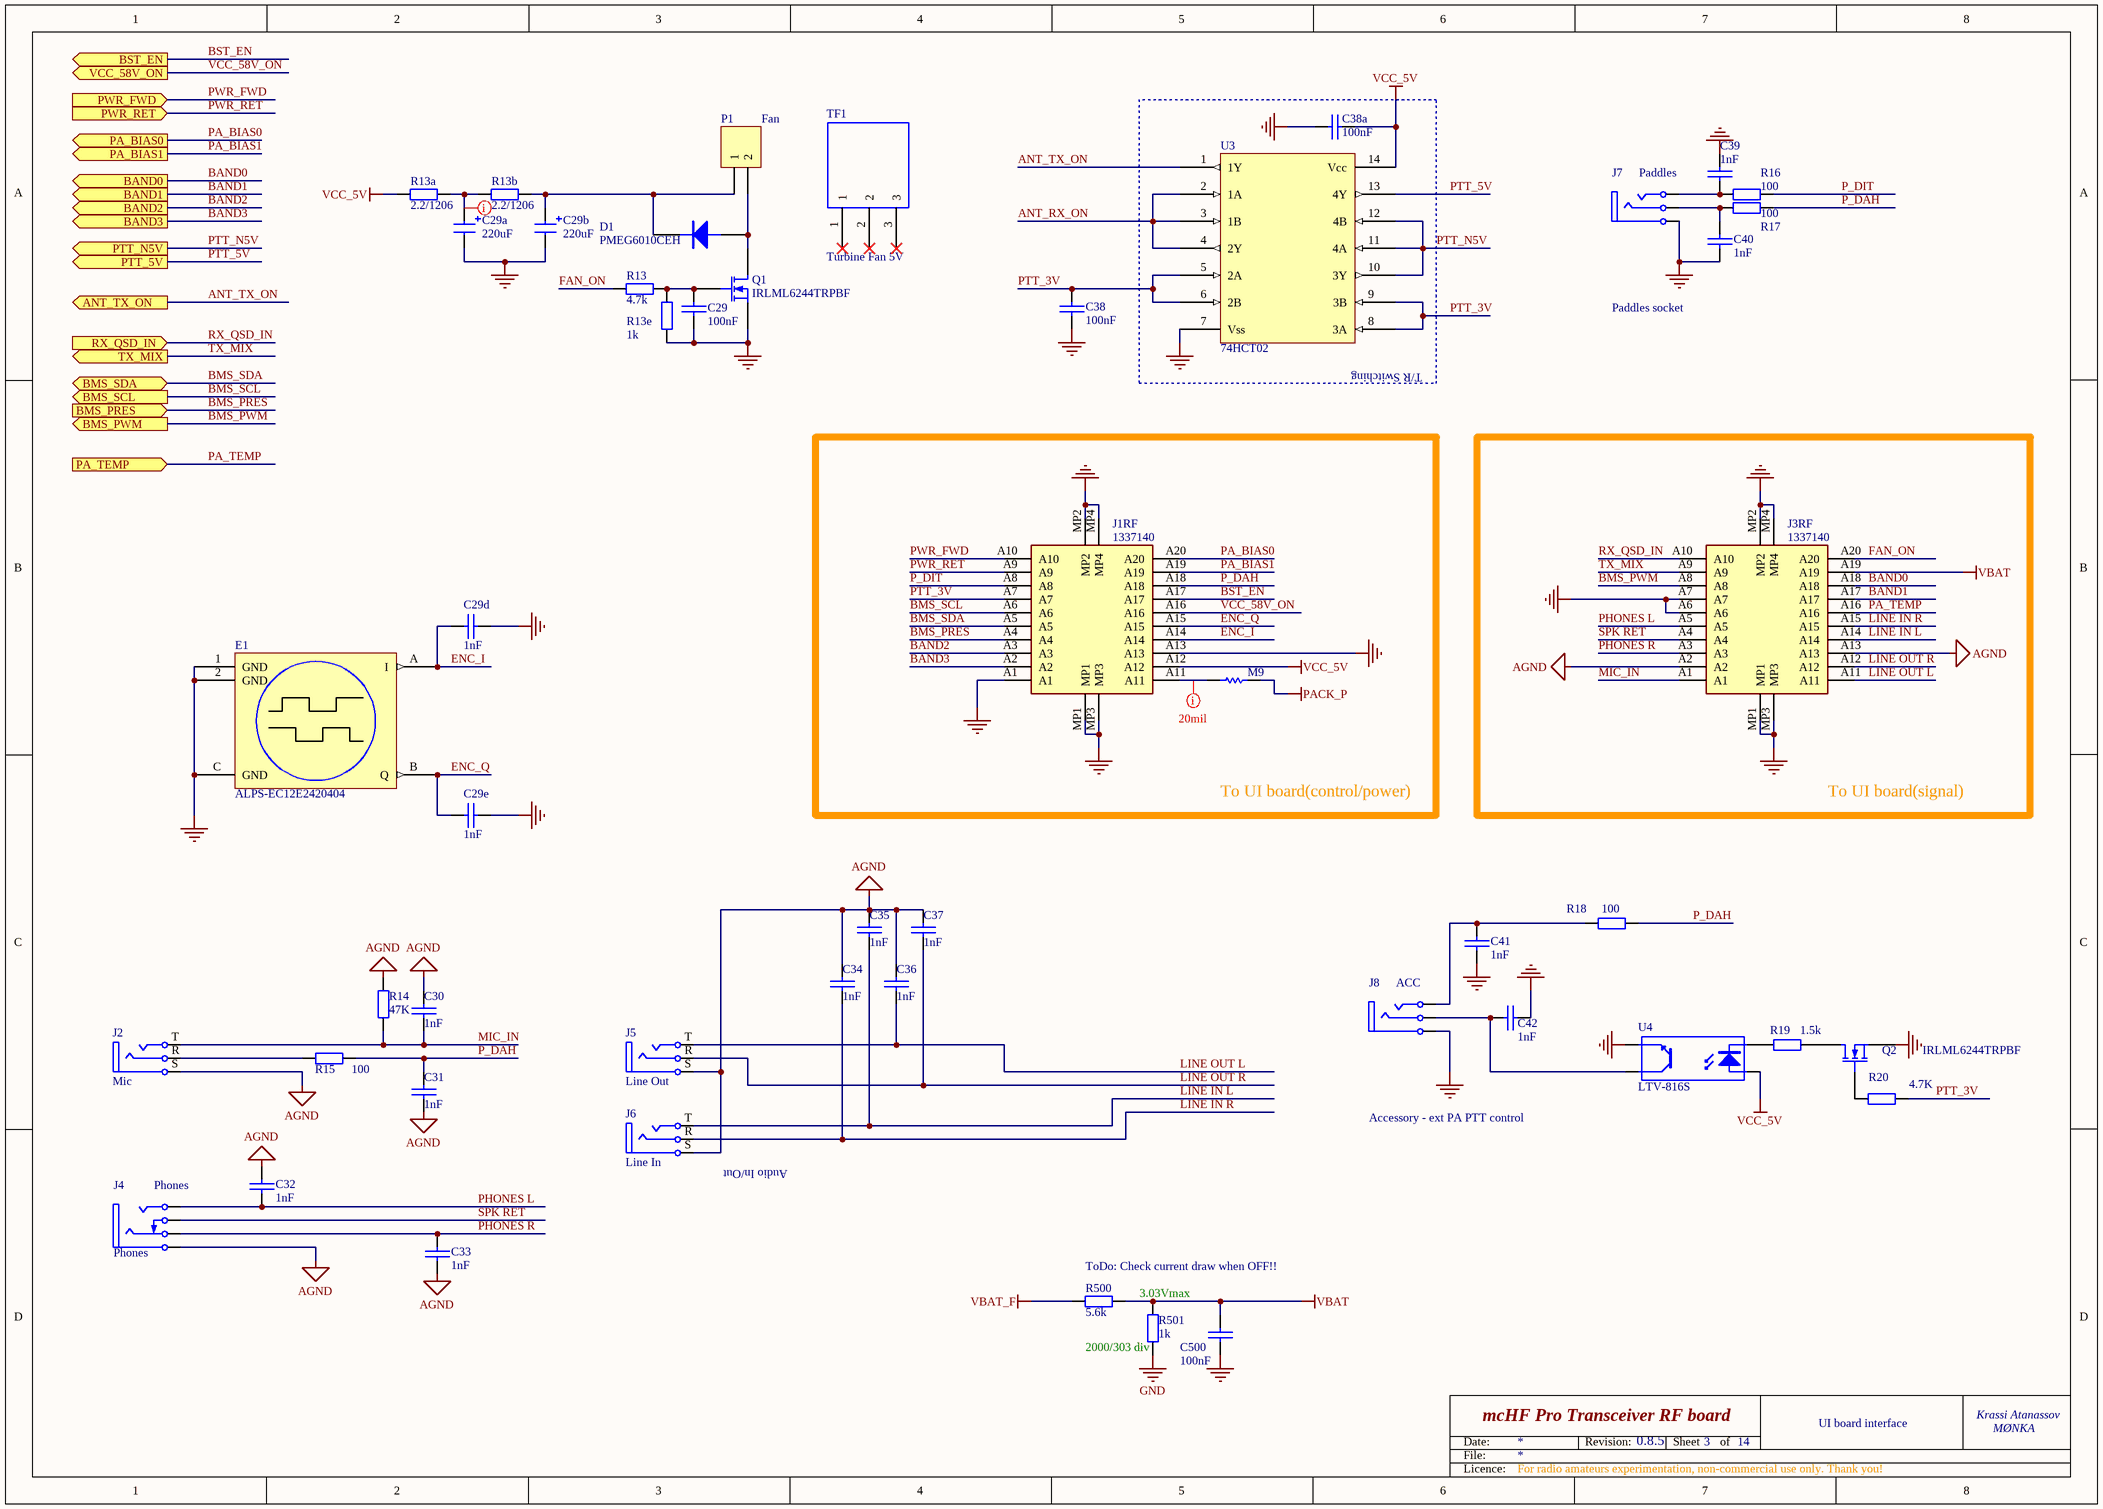
[diagram p9: rf_conn.SchDoc]

### Parts
C29  100nF  [0805]
C29a  220uF  [CAP_ALUM_Pro]
C29b  220uF  [CAP_ALUM_Pro]
C29d  1nF  [0805]
C29e  1nF  [0805]
C30  1nF  [0805]
C31  1nF  [0805]
C32  1nF  [0805]
C33  1nF  [0805]
C34  1nF  [0805]
C35  1nF  [0805]
C36  1nF  [0805]
C37  1nF  [0805]
C38  100nF  [0805]
C38a  100nF  [0805]
C39  1nF  [0805]
C40  1nF  [0805]
C41  1nF  [0805]
C42  1nF  [0805]
C500  100nF  [0805]
D1  PMEG6010CEH  [SOD87]
E1  ALPS-EC12E2420404  [Encoder]
J1RF  1337140  [1373866]
J2  Mic  [MX-387GL_new1]
J3RF  1337140  [1373866]
J4  Phones  [KLBR4]
J5  Line Out  [MX-387GL_new1]
J6  Line In  [MX-387GL_new1]
J7  Paddles  [MX-387GL_new1]
J8  ACC  [MX-387GL_new1]
M9  0  [SB_0603_10]  (value not drawn)  (net tie, no BOM)
P1  Fan  [MHDR1X2_m]
Q1  IRLML6244TRPBF  [SOT-23-Pro]
Q2  IRLML6244TRPBF  [SOT-23-Pro]
R13  4.7k  [0805]
R13a  2.2/1206  [1206]
R13b  2.2/1206  [1206]
R13e  1k  [0805]
R14  47K  [0805]
R15  100  [0805]
R16  100  [0805]
R17  100  [0805]
R18  100  [0805]
R19  1.5k  [0805]
R20  4.7K  [0805]
R500  5.6k  [0805]
R501  1k  [0805]
TF1  Turbine Fan 5V  [TFAN]
U3  74HCT02  [SO-14]
U4  LTV-816S  [SMDIP-4_new1]

### Blocks framed on the sheet
T/R Switching: C38a U3
To UI board(control/power): J1RF M9
To UI board(signal): J3RF

### Ports
ANT_TX_ON (out), BAND0 (out), BAND1 (out), BAND2 (out), BAND3 (out), BMS_PRES (in), BMS_PWM (out), BMS_SCL (out), BMS_SDA (bidir), BST_EN (out), PA_BIAS0 (out), PA_BIAS1 (out), PA_TEMP (in), PTT_5V (out), PTT_N5V (out), PWR_FWD (in), PWR_RET (in), RX_QSD_IN (in), TX_MIX (out), VCC_58V_ON (out)

### Nets
AGND: C30.1 C31.2 C32.2 C33.1 C34.1 C35.1 C36.1 C37.1 J2.S J3RF.A2 J3RF.A13 J4.S J5.S J6.S R14.2
GND: C29.2 C29a.2 C29b.2 C29d.2 C29e.2 C38.2 C38a.2 C39.2 C40.1 C41.2 C42.1 C500.2 E1.1(GND) E1.2(GND) E1.C(GND) J1RF.A1 J1RF.A13 J1RF.MP1 J1RF.MP2 J1RF.MP3 J1RF.MP4 J3RF.A6 J3RF.A7 J3RF.MP1 J3RF.MP2 J3RF.MP3 J3RF.MP4 J7.S J8.S Q1.2(S) Q2.2(S) R13e.2 R501.2 U3.7(Vss) U4.3(E)
PACK_P: M9.2
VBAT: C500.1 J3RF.A19 R500.2 R501.1
VBAT_F: R500.1
VCC_5V: C38a.1 J1RF.A12 R13a.1 U3.14(Vcc) U4.1(A)
ANT_RX_ON: U3.2(1A) U3.3(1B) U3.4(2Y)
ANT_TX_ON: U3.1(1Y) ; port ANT_TX_ON
BAND0: J3RF.A18 ; port BAND0
BAND1: J3RF.A17 ; port BAND1
BAND2: J1RF.A3 ; port BAND2
BAND3: J1RF.A2 ; port BAND3
BMS_PRES: J1RF.A4 ; port BMS_PRES
BMS_PWM: J3RF.A8 ; port BMS_PWM
BMS_SCL: J1RF.A6 ; port BMS_SCL
BMS_SDA: J1RF.A5 ; port BMS_SDA
BST_EN: J1RF.A17 ; port BST_EN
ENC_I: C29d.1 E1.A(I) J1RF.A14
ENC_Q: C29e.1 E1.B(Q) J1RF.A15
FAN_ON: J3RF.A20 R13.2
LINE IN L: C35.2 J3RF.A14 J6.T
LINE IN R: C34.2 J3RF.A15 J6.R
LINE OUT L: C36.2 J3RF.A11 J5.T
LINE OUT R: C37.2 J3RF.A12 J5.R
MIC_IN: C30.2 J2.T J3RF.A1 R14.1
P_DAH: C31.1 J1RF.A18 R15.2 R17.1 R18.1
P_DIT: J1RF.A8 R16.1
PA_BIAS0: J1RF.A20 ; port PA_BIAS0
PA_BIAS1: J1RF.A19 ; port PA_BIAS1
PA_TEMP: J3RF.A16 ; port PA_TEMP
PHONES L: C32.1 J3RF.A5 J4.T
PHONES R: C33.2 J3RF.A3 J4.R
PTT_3V: C38.1 J1RF.A7 R20.2 U3.5(2A) U3.6(2B) U3.8(3A) U3.9(3B)
PTT_5V: U3.13(4Y) ; port PTT_5V
PTT_N5V: U3.10(3Y) U3.11(4A) U3.12(4B) ; port PTT_N5V
PWR_FWD: J1RF.A10 ; port PWR_FWD
PWR_RET: J1RF.A9 ; port PWR_RET
RX_QSD_IN: J3RF.A10 ; port RX_QSD_IN
SPK RET: J3RF.A4 J4.B
TX_MIX: J3RF.A9 ; port TX_MIX
VCC_58V_ON: J1RF.A16 ; port VCC_58V_ON
NetC29_1: C29.1 Q1.1(G) R13.1 R13e.1
NetC29a_1: C29a.1 R13a.2 R13b.1
NetC29b_1: C29b.1 D1.2(K) P1.1 R13b.2
NetC39_1: C39.1 J7.T R16.2
NetC40_2: C40.2 J7.R R17.2
NetC41_1: C41.1 J8.T R18.2
NetC42_2: C42.2 J8.R U4.4(C)
NetD1_1: D1.1(A) P1.2 Q1.3(D)
NetJ1RF_A11: J1RF.A11 M9.1
NetJ2_R: J2.R R15.1
NetQ2_1: Q2.1(G) R20.1
NetQ2_3: Q2.3(D) R19.2
NetR19_1: R19.1 U4.2(K)

Not connected (* = marked no-connect by the designer): TF1 1* 2* 3*

### Layout directives
rule Width Constraint [Pref Width = 20mil    Min Width = 20mil    Max Width = 80mil]: NetJ1RF_A11
rule Width Constraint [Pref Width = 12mil    Min Width = 12mil    Max Width = 12mil]: NetC29a_1

### Notes on the sheet
- Paddles socket
- Accessory - ext PA PTT control
- (near J6) Audio In/Out
- ToDo: Check current draw when OFF!!
- (near R501) 3.03Vmax
- (near R501) 2000/303 div
- 3
- UI board interface
- Date:
- File:
- Revision:
- Sheet
- of
- Licence:

### Library data of the parts
C29 C29d C29e C30-C37 = CAP: Capacitor; Order: FN 185-6408; QT Order: QCC-00259; Price: 0.01
C29a = CAP-POL: Electrolitic capacitor; Order: FN 225-4321; QT Order: QCC-00320; Price: 0.34
C29b = CAP-POL: Electrolitic capacitor; Notes: Aluminium capacitor; Price: 0.34
C38 C38a C500 = CAP: Capacitor; QT Order: QCC-00154; Price: 0.068
C39-C42 = CAP: Capacitor; QT Order: QCC-00259; Price: 0.01
D1 = PMEG6010CEH: as D5 on sheet rf_tx_pa; Price: 0.085
E1 = Encoder: ALPS Rotary Encoder
J1RF J3RF = 1373866: SMD male connector, nominal current: 2.2 A, Test voltage: 840 VAC, number of positions: 20, pitch: 1.27 mm, color: black, contact surface: Gold, type of contact: Male connector, mounting: SMD soldering; Manufacturer_Name: Phoenix Contact; Geometry.Height: 6.75mm; Mouser Part Number: 651-1373866; Mouser Price/Stock: https://www.mouser.co.uk/ProductDetail/Phoenix-Contact/1373866?qs=2SLPxufLcgAs0enIXKjUUw%3D%3D; Manufacturer_Part_Number: 1373866; Datasheet Link: http://www.phoenixcontact.com/gb/produkte/1373866
J2 J5 J6 = MX-387GL: Jack Socket,Thru-Hole; Order: FN 126-7376
J4 = PhoneJack: Jack Socket 4 pin; Order: FN 121-7016; Price: 1.28; Function: Phones
J7 J8 = Phonejack3: Jack Socket,Thru-Hole; Notes: post assembly; Price: 0.35
  J7: Function: Paddles
  J8: Function: ACC
M9 = Link: Value: 1K; Published: 8-Jun-2000; Revision: July-2002: Re-released for DXP Platform.; Publisher: Altium Limited
P1 = MHDR1X2: Header, 2-Pin; LatestRevisionDate: 17-Jul-2002; LatestRevisionNote: Re-released for DXP Platform.; Publisher: Altium Limited
Q1 Q2 = MOSFET-N: N-Channel MOSFET; QT Order: QCT-00022; QT Price: 0.28; Price: 0.231
R13 R13e R14 = RES: Resistor; Order: FN 146-9929; QT Order: QCR-00365; Price: 0.021
R13a R13b = RES: Resistor; Order: FN 207-8984; QT Order: QCR-00412; Price: 0.02
R15 = RES: Resistor; Order: FN 933-2375; QT Order: QCR-00301; Price: 0.027
R16-R18 = RES: Resistor; QT Order: QCR-00301; Price: 0.027
R19 = RES: Resistor; QT Order: QCR-00579; Price: 0.061
R20 = RES: Resistor; QT Order: QCR-00341; Price: 0.024
R500 R501 = RES: Resistor; Notes: Tolerance better than 1%; Price: 0.009
TF1 = FAN5V: 5V Turbine Fan, 40x40mm; Order: FN 118-1070; Price: 2.19
U3 = 74HCT02: Quad 2-input NOR gate; QT Order: QCI-01079; Price: 0.38
U4 = ISP817XSM: OPTOCOUPLER, SMDIP-4, TR O/P; Order: FN 168-3292; Notes: v 0.6 RF board opto can do, but more expensive; Price: 0.26

## Sheet rf_bms.SchDoc: mcHF Pro Transceiver RF board
size A3; Author: Krassi Atanassov; CompanyName: MØNKA; Engineer: For radio amateurs experimentation, non-commercial use only. Thank you!; Revision: 0.8.5; SheetTotal: 14
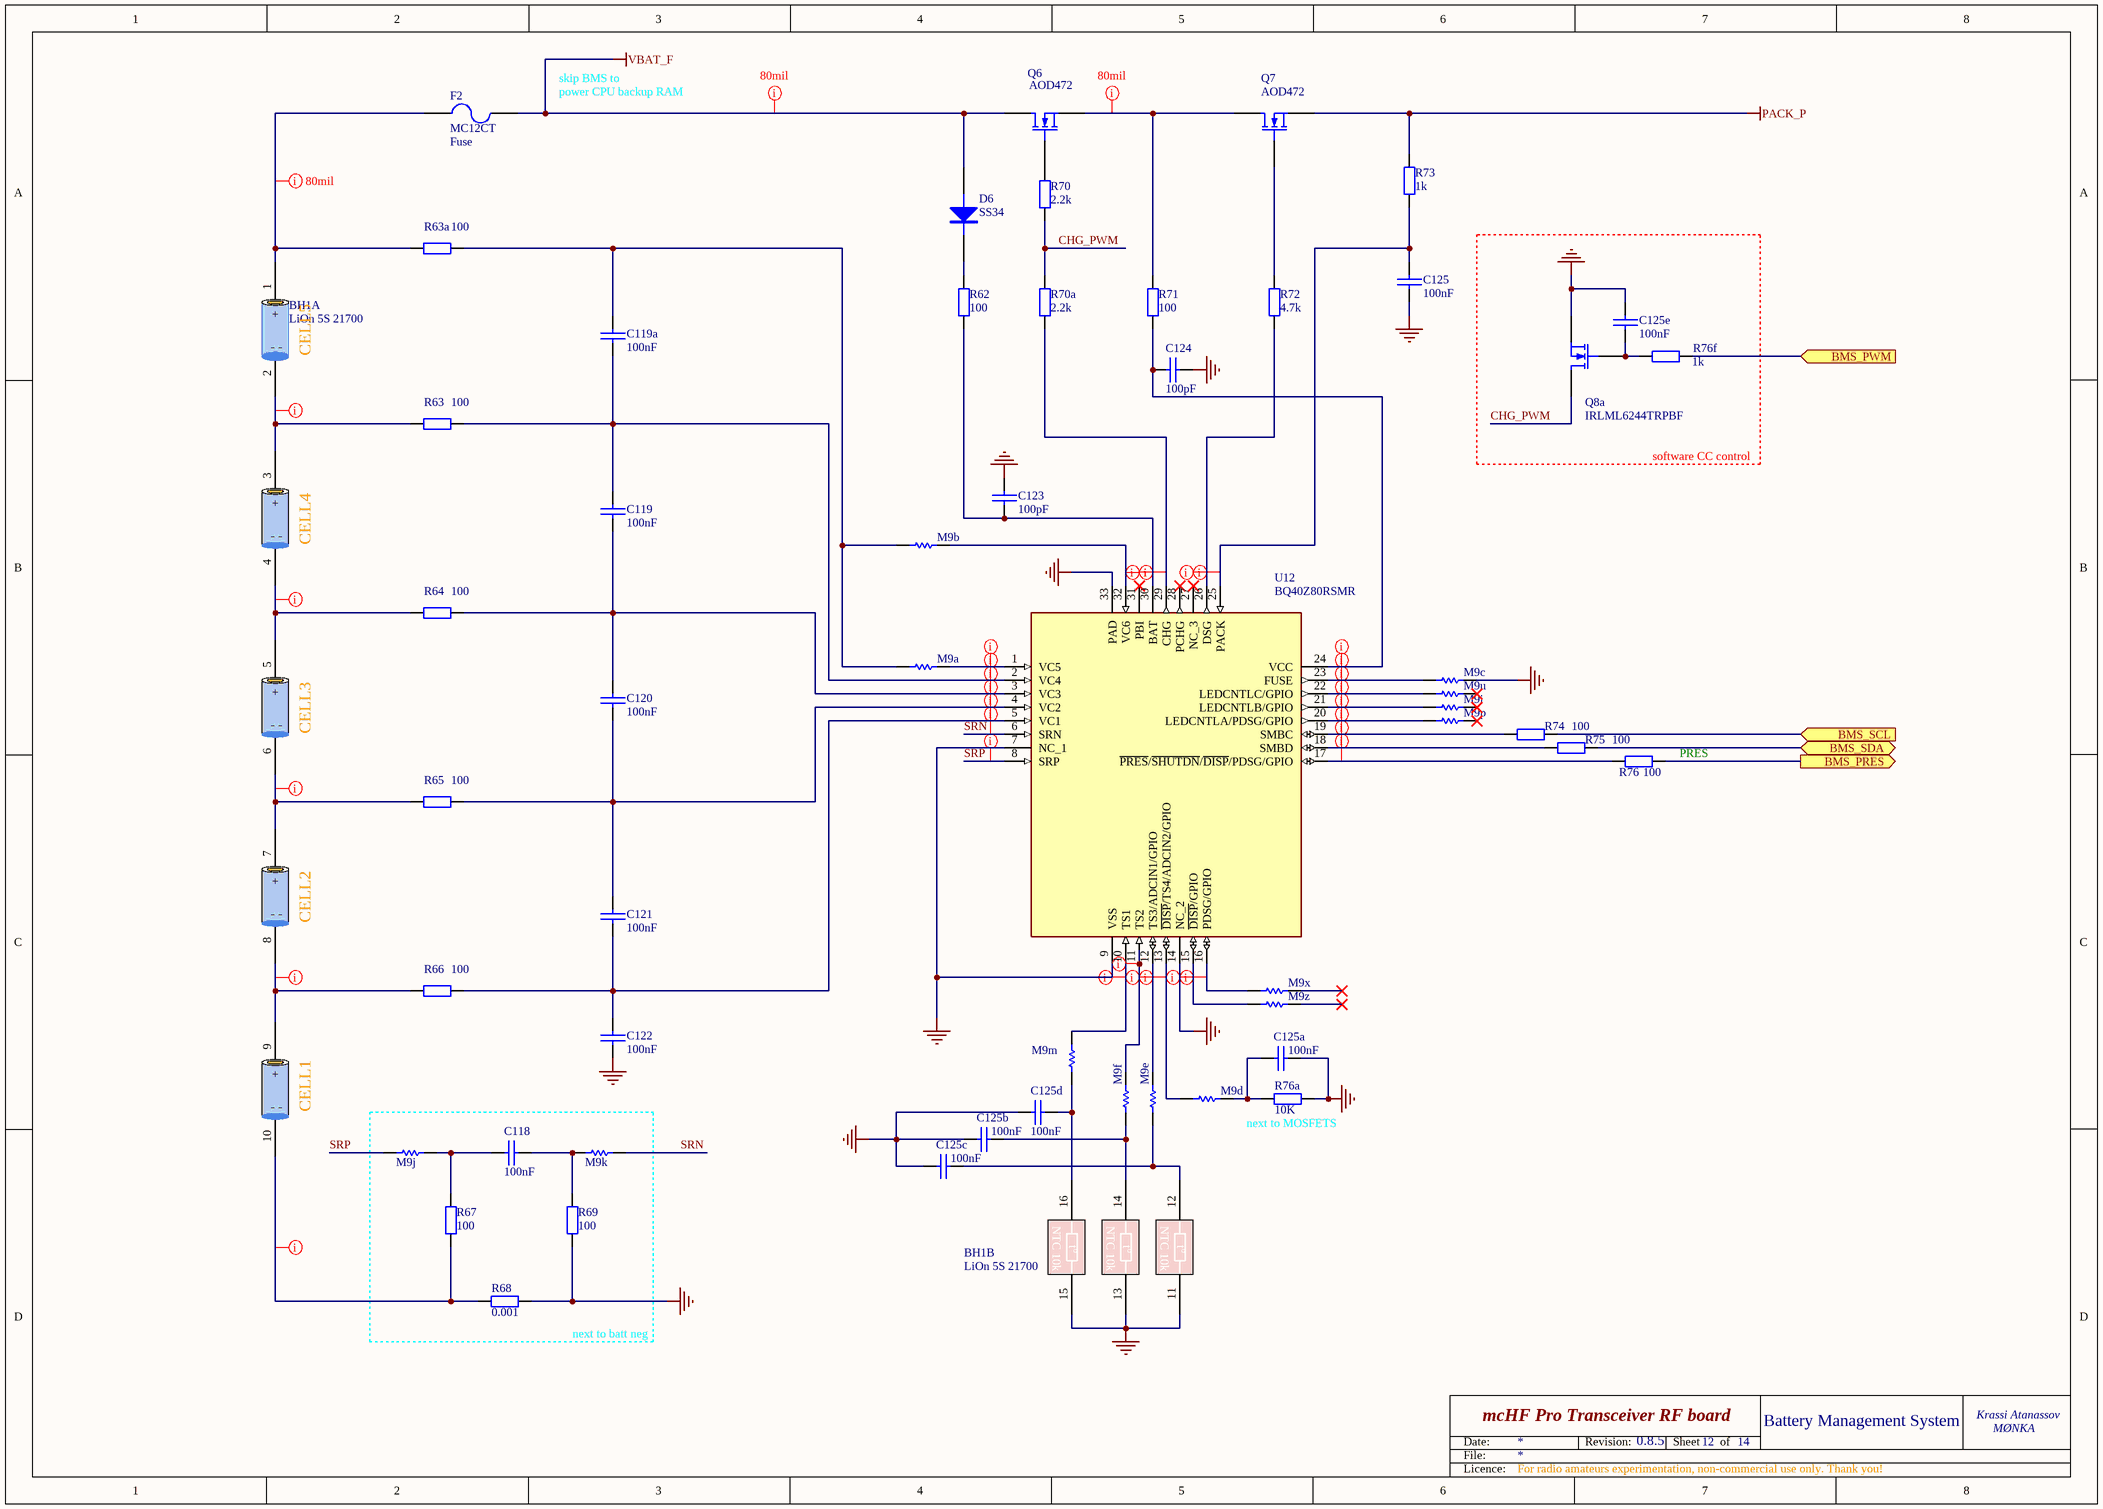
[diagram p10: rf_bms.SchDoc]

### Parts
BH1  LiOn 5S 21700  [BATT_HOLDER_5S]  (parts A,B of 2)
C118  100nF  [0805]
C119  100nF  [0805]
C119a  100nF  [0805]
C120  100nF  [0805]
C121  100nF  [0805]
C122  100nF  [0805]
C123  100pF  [0805]
C124  100pF  [0805]
C125  100nF  [0805]
C125a  100nF  [0805]
C125b  100nF  [0805]
C125c  100nF  [0805]
C125d  100nF  [0805]
C125e  100nF  [0805]
D6  SS34  [DO214]
F2  MC12CT  [1206]
M9a  0  [SB_0603_10]  (value not drawn)  (net tie, no BOM)
M9b  0  [SB_0603_10]  (value not drawn)  (net tie, no BOM)
M9c  0  [SB_0603_10]  (value not drawn)  (net tie, no BOM)
M9d  0  [SB_0603_10]  (value not drawn)  (net tie, no BOM)
M9e  0  [SB_0603_10]  (value not drawn)  (net tie, no BOM)
M9f  0  [SB_0603_10]  (value not drawn)  (net tie, no BOM)
M9i  0  [SB_0603_10]  (value not drawn)  (net tie, no BOM)
M9j  0  [SB_0603_10]  (value not drawn)  (net tie, no BOM)
M9k  0  [SB_0603_10]  (value not drawn)  (net tie, no BOM)
M9m  0  [SB_0603_10]  (value not drawn)  (net tie, no BOM)
M9p  0  [SB_0603_10]  (value not drawn)  (net tie, no BOM)
M9u  0  [SB_0603_10]  (value not drawn)  (net tie, no BOM)
M9x  0  [SB_0603_10]  (value not drawn)  (net tie, no BOM)
M9z  0  [SB_0603_10]  (value not drawn)  (net tie, no BOM)
Q6  AOD472  [TO-252]
Q7  AOD472  [TO-252]
Q8a  IRLML6244TRPBF  [SOT-23-Pro]
R62  100  [0805]
R63  100  [0805]
R63a  100  [0805]
R64  100  [0805]
R65  100  [0805]
R66  100  [0805]
R67  100  [0805]
R68  0.001  [2512]
R69  100  [0805]
R70  2.2k  [0805]
R70a  2.2k  [0805]
R71  100  [0805]
R72  4.7k  [0805]
R73  1k  [0805]
R74  100  [0805]
R75  100  [0805]
R76  100  [0805]
R76a  10K  [0805]
R76f  1k  [0805]
U12  BQ40Z80RSMR  [QFN40P400X400X100-33N-D]

### Blocks framed on the sheet
software CC control: C125e Q8a R76f
next to batt neg: C118 M9j M9k R67-R69

### Ports
BMS_PRES (out), BMS_PWM (in), BMS_SCL (in), BMS_SDA (bidir)

### Nets
GND: BH1.11 BH1.13 BH1.15 C122.2 C123.1 C124.1 C125.2 C125a.1 C125b.2 C125c.2 C125d.2 C125e.2 M9c.2 Q8a.2(S) R68.2 R69.2 R76a.2 U12.7(NC_1) U12.9(VSS) U12.14(NC_2) U12.33(PAD)
PACK_P: Q7.3(S) R73.2
VBAT_F: D6.1(A) F2.2 Q6.2(D)
BMS_PRES: R76.2 ; port BMS_PRES
BMS_PWM: R76f.2 ; port BMS_PWM
BMS_SCL: R74.2 ; port BMS_SCL
BMS_SDA: R75.2 ; port BMS_SDA
CHG_PWM: Q8a.3(D) R70.1 R70a.2
SRN: M9k.1 U12.6(SRN)
SRP: M9j.2 U12.8(SRP)
NetBH1_1: BH1.1(+) F2.1 R63a.2
NetBH1_2: BH1.2(|) BH1.3(+) R63.2
NetBH1_4: BH1.4(|) BH1.5(+) R64.2
NetBH1_6: BH1.6(|) BH1.7(+) R65.2
NetBH1_8: BH1.8(|) BH1.9(+) R66.2
NetBH1_10: BH1.10(|) R67.2 R68.1
NetBH1_12: BH1.12 C125c.1 M9e.2
NetBH1_14: BH1.14 C125b.1 M9f.2
NetBH1_16: BH1.16 C125d.1 M9m.1
NetC118_1: C118.1 M9k.2 R69.1
NetC118_2: C118.2 M9j.1 R67.1
NetC119_1: C119.1 C119a.2 R63.1 U12.2(VC4)
NetC119_2: C119.2 C120.1 R64.1 U12.3(VC3)
NetC119a_1: C119a.1 M9a.1 M9b.1 R63a.1
NetC120_2: C120.2 C121.1 R65.1 U12.4(VC2)
NetC121_2: C121.2 C122.1 R66.1 U12.5(VC1)
NetC123_2: C123.2 R62.1 U12.30(BAT)
NetC124_2: C124.2 R71.2 U12.24(VCC)
NetC125_1: C125.1 R73.1 U12.25(PACK)
NetC125a_2: C125a.2 M9d.2 R76a.1
NetC125e_1: C125e.1 Q8a.1(G) R76f.1
NetD6_2: D6.2(K) R62.2
NetM9a_2: M9a.2 U12.1(VC5)
NetM9b_2: M9b.2 U12.32(VC6)
NetM9c_1: M9c.1 U12.23(FUSE)
NetM9d_1: M9d.1 U12.13(~{DISP}/TS4/ADCIN2/GPIO)
NetM9e_1: M9e.1 U12.12(TS3/ADCIN1/GPIO)
NetM9f_1: M9f.1 U12.11(TS2)
NetM9i_1: M9i.1 U12.21(LEDCNTLB/GPIO)
NetM9m_2: M9m.2 U12.10(TS1)
NetM9p_1: M9p.1 U12.20(LEDCNTLA/PDSG/GPIO)
NetM9u_1: M9u.1 U12.22(LEDCNTLC/GPIO)
NetM9x_1: M9x.1 U12.16(PDSG/GPIO)
NetM9z_1: M9z.1 U12.15(~{DISP}/GPIO)
NetQ6_1: Q6.1(G) R70.2
NetQ6_3: Q6.3(S) Q7.2(D) R71.1
NetQ7_1: Q7.1(G) R72.2
NetR70a_1: R70a.1 U12.29(CHG)
NetR72_1: R72.1 U12.26(DSG)
NetR74_1: R74.1 U12.19(SMBC)
NetR75_1: R75.1 U12.18(SMBD)
NetR76_1: R76.1 U12.17(~{PRES}/~{SHUTDN}/~{DISP}/PDSG/GPIO)

Not connected (* = marked no-connect by the designer): M9i 2*; M9p 2*; M9u 2*; M9x 2*; M9z 2*; U12 27(NC_3)* 28(PCHG)* 31(PBI)*

### Layout directives
rule Width Constraint [Pref Width = 80mil    Min Width = 80mil    Max Width = 80mil]: NetBH1_1, NetBH1_2, NetBH1_4, NetBH1_6, NetBH1_8, NetBH1_10, NetQ6_3, VBAT_F
rule Width Constraint [Pref Width = 8mil    Min Width = 8mil    Max Width = 8mil]: NetC119_1, NetC119_2, NetC120_2, NetC121_2, NetC123_2, NetC124_2, NetC125_1, NetM9a_2, NetM9b_2, NetM9c_1, NetM9d_1, NetM9e_1, NetM9f_1, NetM9i_1, NetM9p_1, NetM9u_1, NetM9x_1, NetM9z_1, NetR70a_1, NetR72_1, NetR74_1, NetR75_1, NetR76_1
rule Width Constraint [Pref Width = 6mil    Min Width = 6mil    Max Width = 6mil]: NetM9m_2, SRN, SRP

### Notes on the sheet
- skip BMS to
- power CPU backup RAM
- (near BH1) CELL5
- (near BH1) CELL4
- (near BH1) CELL3
- (near R76) PRES
- (near BH1) CELL2
- (near BH1) CELL1
- next to MOSFETS
- 12
- Battery Management System
- Date:
- File:
- Revision:
- Sheet
- of
- Licence:
- (in symbol BATT_HOLDER_5S_21700, part B) NTC 10k; t°

### Library data of the parts
BH1 = BATT_HOLDER_5S_21700: LiOn 21700 5S Holder
C118 C119 C119a C120-C125 = CAP: Capacitor; Voltage: 100V
C125a C125b C125c C125d C125e = CAP: as C92 on sheet rf_tx_pa; Price: 0.068
D6 = PMEG6010CEH: as D5 on sheet rf_tx_pa; Price: 0.085
F2 = Fuse: QT Order: QCI-00216; Price: 0.134; Function: Fuse
M9a M9b M9c M9d M9e M9f M9i M9j M9k M9m M9p M9u M9x M9z = Link: Value: 1K; Published: 8-Jun-2000; Revision: July-2002: Re-released for DXP Platform.; Publisher: Altium Limited
Q6 Q7 = AOD472: N-Channel Enhancement Mode Field Effect Transistor, TO-252; Order: FN 108-1300; Price: 0.161
Q8a = MOSFET-N: as Q1 on sheet rf_conn; Price: 0.231
R62 R63 R63a R64-R66 = RES: Resistor; QT Order: QCR-00309; Price: 0.007
R67 R69 R70 R70a R71-R76 R76f = RES: Resistor
  R67 R69 R71 R74-R76 R76f: Price: 0.046
R68 = RES: Resistor; Order: 652-CR2512AF/1R00ELF; QT Order: QCR-00268; Notes: Tolerance better than 1%; Price: 0.009
R76a = RES: Resistor; QT Order: QCR-00579; Price: 0.061
U12 = BQ40Z80RSMR: Hardware; Manufacturer_Name: Texas Instruments; Datasheet Link: https://www.arrow.com/en/products/bq40z80rsmr/texas-instruments; Height: 1mm; Manufacturer_Part_Number: BQ40Z80RSMR; Mouser Part Number: 595-BQ40Z80RSMR; Mouser Price/Stock: https://www.mouser.co.uk/ProductDetail/Texas-Instruments/BQ40Z80RSMR?qs=%252BEew9%252B0nqrAXLQXqHAvhdw%3D%3D; Arrow Part Number: BQ40Z80RSMR; Arrow Price/Stock: https://www.arrow.com/en/products/bq40z80rsmr/texas-instruments

## Sheet rf_smps.SchDoc: mcHF Pro Transceiver RF board
size A3; Author: Krassi Atanassov; CompanyName: MØNKA; Engineer: For radio amateurs experimentation, non-commercial use only. Thank you!; Revision: 0.8.5; SheetTotal: 14
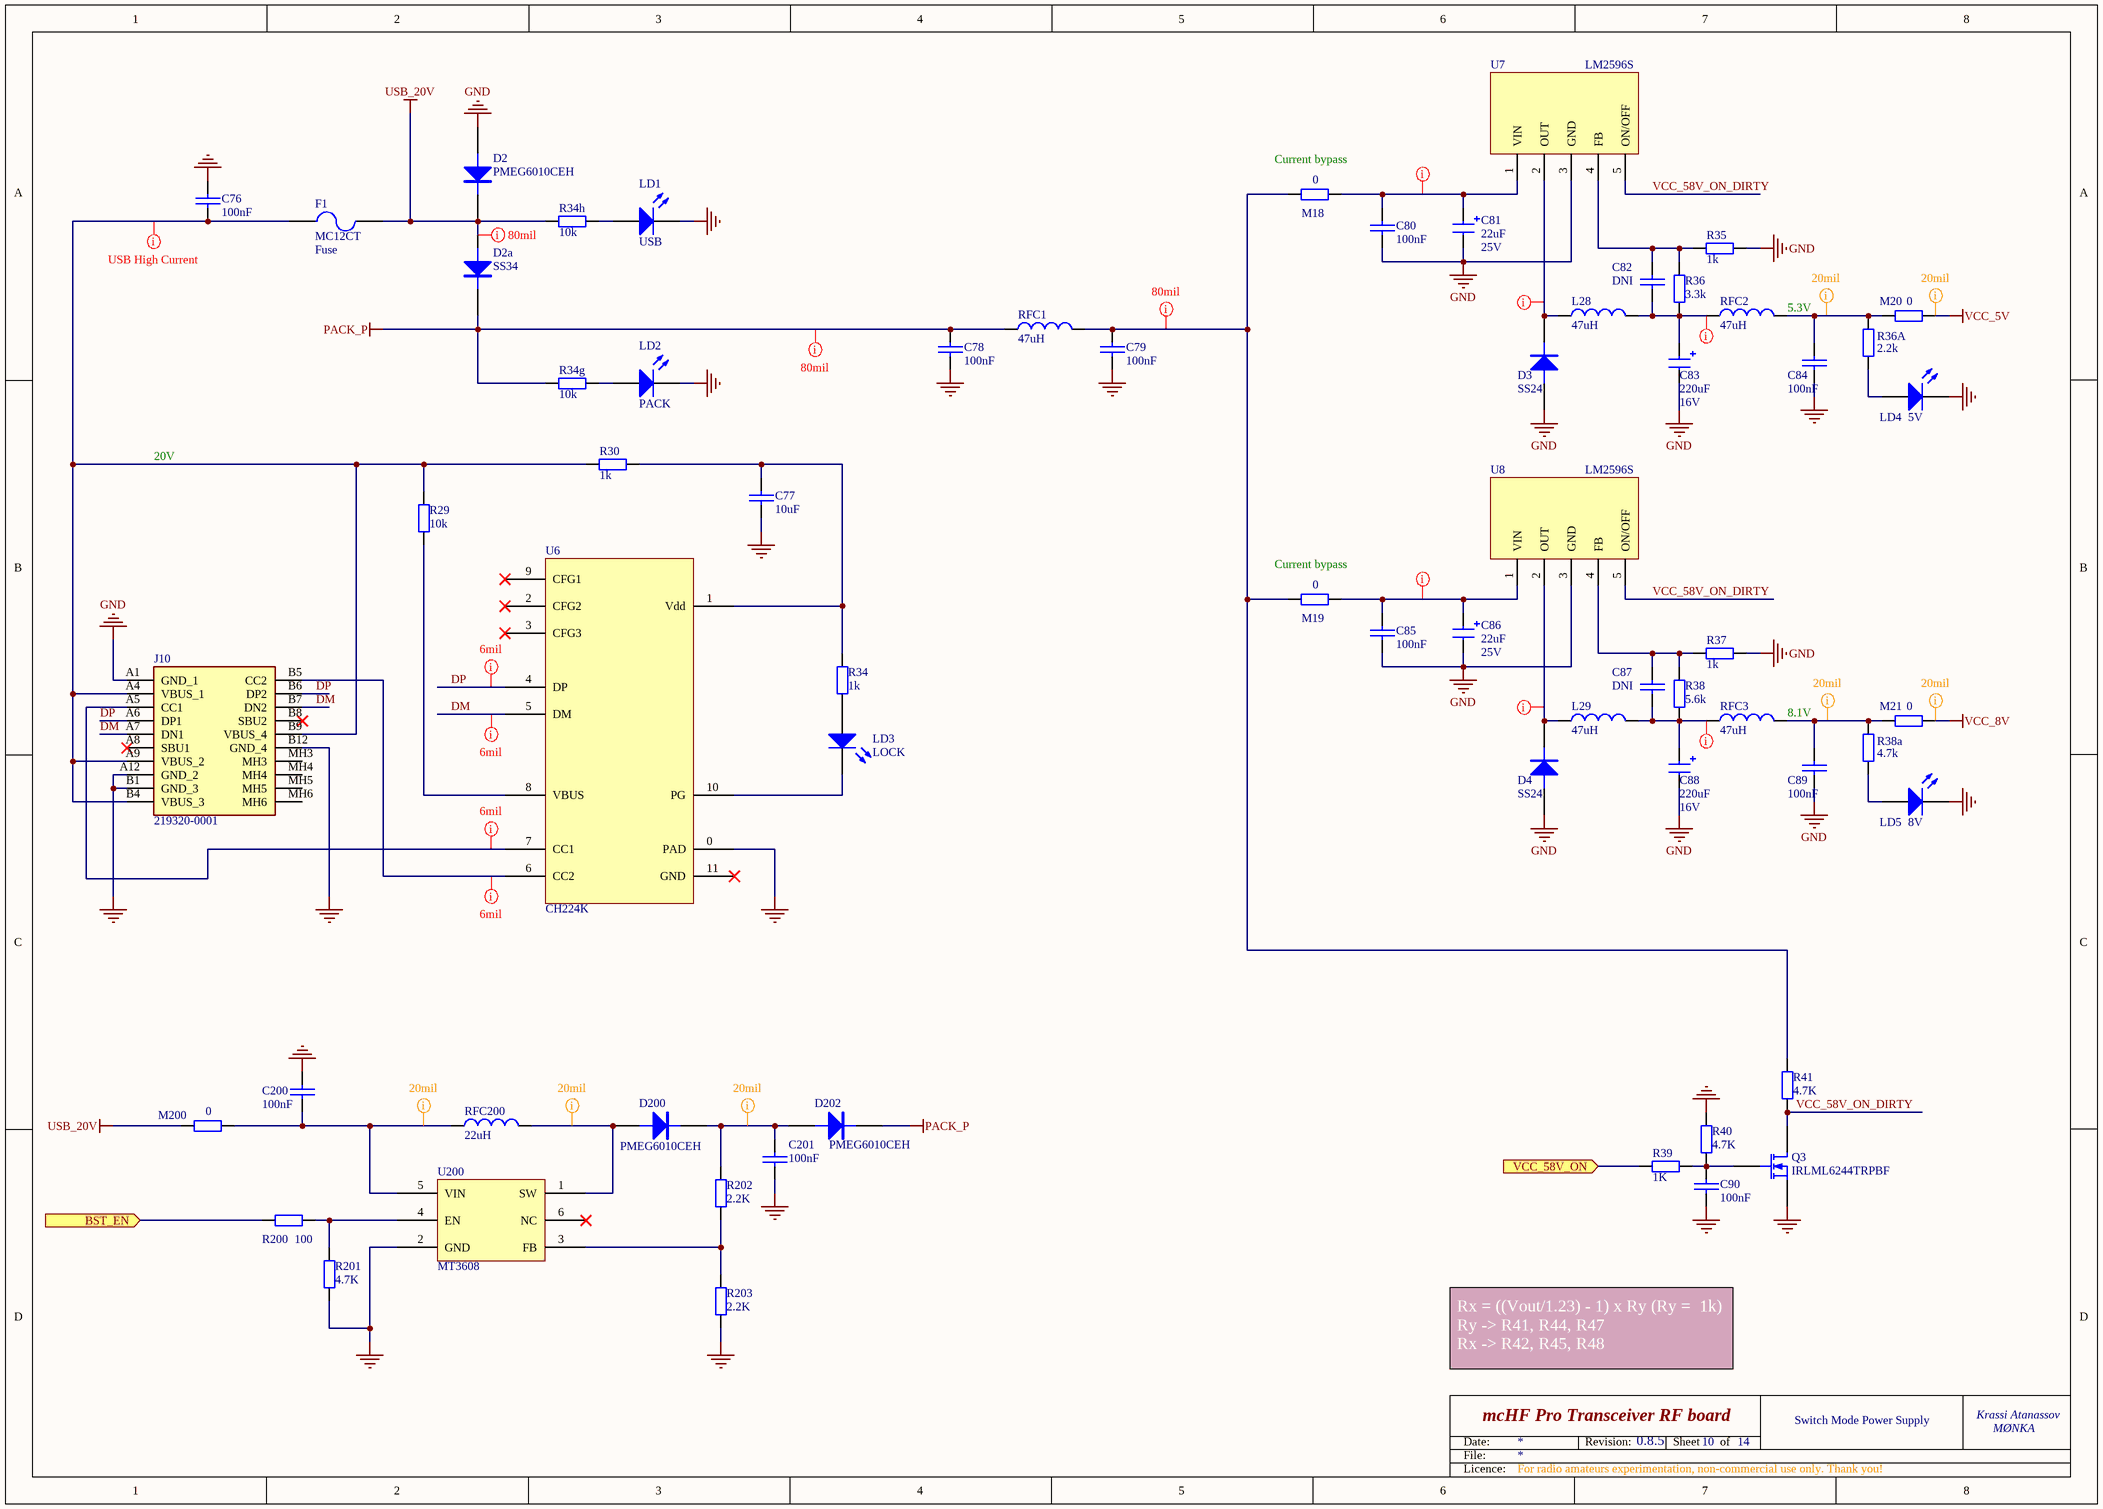
[diagram p11: rf_smps.SchDoc]

### Parts
C76  100nF  [0805]
C77  10uF  [0805]
C78  100nF  [0805]
C79  100nF  [0805]
C80  100nF  [0805]
C81  22uF  Voltage: 25V  [1206_Elec_Cap]
C82  DNI  [0805]  (no BOM)
C83  220uF  Voltage: 16V  [CAP_ALUM_Pro]
C84  100nF  [0805]
C85  100nF  [0805]
C86  22uF  Voltage: 25V  [1206_Elec_Cap]
C87  DNI  [0805]  (no BOM)
C88  220uF  Voltage: 16V  [CAP_ALUM_Pro]
C89  100nF  [0805]
C90  100nF  [0805]
C200  100nF  [0805]
C201  100nF  [0805]
D2  PMEG6010CEH  [SOD87]
D2a  SS34  [DO214]
D3  SS24  [DO214]
D4  SS24  [DO214]
D200  PMEG6010CEH  [SOD87]
D202  PMEG6010CEH  [SOD87]
F1  MC12CT  [1206]
J10  219320-0001  [MOLX_USB]
L28  47uH  [CD75]
L29  47uH  [CD75]
LD1  USB  [1206_Elec_Cap]  (no BOM)
LD2  PACK  [1206_Elec_Cap]  (no BOM)
LD3  LOCK  [1206_Elec_Cap]  (no BOM)
LD4  5V  [1206_Elec_Cap]  (no BOM)
LD5  8V  [1206_Elec_Cap]  (no BOM)
M18  0  [0805]
M19  0  [0805]
M20  0  [0805]
M21  0  [0805]
M200  0  [0805]
Q3  IRLML6244TRPBF  [SOT-23-Pro]
R29  10k  [0805]
R30  1k  [0805]
R34  1k  [0805]
R34g  10k  [0805]
R34h  10k  [0805]
R35  1k  [0805]
R36  3.3k  [0805]
R36A  2.2k  [0805]
R37  1k  [0805]
R38  5.6k  [0805]
R38a  4.7k  [0805]
R39  1K  [0805]
R40  4.7K  [0805]
R41  4.7K  [0805]
R200  100  [0805]
R201  4.7K  [0805]
R202  2.2K  [0805]
R203  2.2K  [0805]
RFC1  47uH  [BIG_IND]
RFC2  47uH  [CD75]
RFC3  47uH  [CD75]
RFC200  22uH  [0805]
U6  CH224K  [ch224k]
U7  LM2596S  [TO-263-5]
U8  LM2596S  [TO-263-5]
U200  MT3608  [SOT25-6]

### Ports
BST_EN (in), VCC_58V_ON (in)

### Nets
GND: C76.1 C77.2 C78.1 C79.1 C80.2 C81.2 C83.2 C84.2 C85.2 C86.2 C88.2 C89.2 C90.2 C200.1 C201.2 D2.1(A) D3.1(A) D4.1(A) J10.A1(GND_1) J10.A12(GND_2) J10.B1(GND_3) J10.B12(GND_4) LD1.2(K) LD2.2(K) LD4.2(K) LD5.2(K) Q3.2(S) R35.2 R37.2 R40.2 R201.1 R203.2 U6.0(PAD) U7.3(GND) U8.3(GND) U200.2(GND)
PACK_P: C78.2 D2a.2(K) D202.2(K) R34g.2 RFC1.1
USB_20V: D2.2(K) D2a.1(A) F1.1 M200.2 R34h.2
VCC_5V: M20.1
VCC_8V: M21.1
BST_EN: R200.1 ; port BST_EN
DM: J10.A7(DN1) J10.B7(DN2) U6.5(DM)
DP: J10.A6(DP1) J10.B6(DP2) U6.4(DP)
VCC_58V_ON: R39.1 ; port VCC_58V_ON
VCC_58V_ON_DIRTY: Q3.3(D) R41.1 U7.5(ON/OFF) U8.5(ON/OFF)
NetC76_2: C76.2 F1.2 J10.A4(VBUS_1) J10.A9(VBUS_2) J10.B4(VBUS_3) J10.B9(VBUS_4) R29.2 R30.1
NetC77_1: C77.1 R30.2 R34.2 U6.1(Vdd)
NetC79_2: C79.2 M18.2 M19.2 R41.2 RFC1.2
NetC80_1: C80.1 C81.1 M18.1 U7.1(VIN)
NetC82_1: C82.1 R35.1 R36.2 U7.4(FB)
NetC82_2: C82.2 C83.1 L28.2 R36.1 RFC2.1
NetC84_1: C84.1 M20.2 R36A.2 RFC2.2
NetC85_1: C85.1 C86.1 M19.1 U8.1(VIN)
NetC87_1: C87.1 R37.1 R38.2 U8.4(FB)
NetC87_2: C87.2 C88.1 L29.2 R38.1 RFC3.1
NetC89_1: C89.1 M21.2 R38a.2 RFC3.2
NetC90_1: C90.1 Q3.1(G) R39.2 R40.1
NetC200_2: C200.2 M200.1 RFC200.1 U200.5(VIN)
NetC201_1: C201.1 D200.2(K) D202.1(A) R202.1
NetD3_2: D3.2(K) L28.1 U7.2(OUT)
NetD4_2: D4.2(K) L29.1 U8.2(OUT)
NetD200_1: D200.1(A) RFC200.2 U200.1(SW)
NetJ10_A5: J10.A5(CC1) U6.7(CC1)
NetJ10_B5: J10.B5(CC2) U6.6(CC2)
NetLD1_1: LD1.1(A) R34h.1
NetLD2_1: LD2.1(A) R34g.1
NetLD3_1: LD3.1(A) R34.1
NetLD3_2: LD3.2(K) U6.10(PG)
NetLD4_1: LD4.1(A) R36A.1
NetLD5_1: LD5.1(A) R38a.1
NetR29_1: R29.1 U6.8(VBUS)
NetR200_2: R200.2 R201.2 U200.4(EN)
NetR202_2: R202.2 R203.1 U200.3(FB)

Not connected (* = marked no-connect by the designer): J10 A8(SBU1)* B8(SBU2)* MH3 MH4 MH5 MH6; U6 2(CFG2)* 3(CFG3)* 9(CFG1)* 11(GND)*; U200 6(NC)*

### Layout directives
rule Width Constraint [Pref Width = 20mil    Min Width = 20mil    Max Width = 20mil]: NetC84_1, NetC89_1, NetC200_2, NetC201_1, NetD200_1, VCC_5V, VCC_8V
rule Width Constraint [Pref Width = 30mil    Min Width = 30mil    Max Width = 30mil]: NetC80_1, NetC82_2, NetC85_1, NetC87_2, NetD3_2, NetD4_2
rule Width Constraint [Pref Width = 80mil    Min Width = 80mil    Max Width = 80mil]: NetC79_2, PACK_P, USB_20V
rule Width Constraint [Pref Width = 24mil    Min Width = 24mil    Max Width = 24mil]: NetC76_2
rule Width Constraint [Pref Width = 6mil    Min Width = 6mil    Max Width = 6mil]: DM, DP, NetJ10_A5, NetJ10_B5

### Notes on the sheet
- (near M18) Current bypass
- (near RFC2) 5.3V
- 20V
- (near M19) Current bypass
- (near RFC3) 8.1V
- Rx = ((Vout/1.23) - 1) x Ry (Ry =  1k)
  Ry -> R41, R44, R47
  Rx -> R42, R45, R48
- 10
- Switch Mode Power Supply
- Date:
- File:
- Revision:
- Sheet
- of
- Licence:

### Library data of the parts
C76 C77 = CAP: Capacitor; QT Order: QCC-00154; Price: 0.068
C78-C80 C82 C84 C85 C87 C89 C90 = CAP: as C92 on sheet rf_tx_pa; Price: 0.068
C81 C83 C86 C88 = CAP-POL: as C96 on sheet rf_tx_pa; Price: 0.235
C200 C201 = CAP: Capacitor; Order: FN 282-1264; QT Order: QCC-00157; Price: 0.089
D2 D2a D3 D4 = PMEG6010CEH: as D5 on sheet rf_tx_pa; Price: 0.085
D200 D202 = PMEG6010CEH: DIODE, SCHOTTKY, 1A, 60V, SOD-123F; Order: FN 151-0694; QT Order: QCD-00034; QT Price: 0.08; Price: 0.262
F1 = Fuse: QT Order: QCI-00216; Price: 0.134; Function: Fuse
J10 = 219320-0001: Universal Serial Bus (USB) Shielded I/O Receptacle, Type C, Vertical, Surface Mount, Height 8.8mm, 16 Circuits, Gold (Au) Flash Plating; Manufacturer_Name: Molex; Geometry.Height: 9.05mm; Mouser Part Number: 538-219320-0001; Mouser Price/Stock: https://www.mouser.co.uk/ProductDetail/Molex/219320-0001?qs=rQFj71Wb1eXha8qVBIXu3A%3D%3D; Manufacturer_Part_Number: 219320-0001; Datasheet Link: https://www.molex.com/content/dam/molex/molex-dot-com/products/automated/en-us/salesdrawingpdf/219/219320/2193200001_sd.pdf?inline
L28 L29 RFC1-RFC3 = TDK-NLV25T: POWER INDUCTOR, 47UH, 1210; Price: 0.166; Notes: Power inductor
LD1-LD5 = LED2: LED 3mm; QT Order: QCD-00052; Revision: July-2002: Re-released for DXP Platform.; Price: 0.116
M18-M21 M200 = RES: Resistor; QT Order: QCR-00268; Price: 0.009
Q3 = MOSFET-N: as Q1 on sheet rf_conn; Price: 0.231
R29 R30 R34 R34g R34h = RES: as R500 on sheet rf_conn; Price: 0.009
R35 R36A R37 R38a R41 = RES: Resistor; QT Order: QCR-00341; Price: 0.024
R36 = RES: Resistor; Order: 71-CRCW08053K30FKEAC; QT Order: QCR-00341; Price: 0.024
R38 = RES: Resistor; Order: 667-ERJ-6GEYJ562V; QT Order: QCR-00341; Price: 0.024
R39 R40 = RES: Resistor
R200 = RES: Resistor; Order: FN 157-6459; QT Order: QCR-00326; Price: 0.061
R201 = RES: Resistor; Order: FN 200-8383; QT Order: QCR-00341; Price: 0.03
R202 R203 = RES: Resistor; Order: FN 188-7289; QT Order: QCR-00333; QT Price: 0.03; Price: 0.075
RFC200 = Inductor: Power Inductor; QT Order: QCL-00097; QT Price: 0.085; Price: 0
U6 = CH224K: USB-PD trigger chip; Order: DK 336-2518-ND; Price: 8.72
U7 U8 = LM2596S: V REG ADJ +5/20V, SMPS TO-263-5; Notes: In bulk from Ali; Price: 1.28
U200 = MT3608: Charge Pump; Order: Hotmcu.com; QT Order: QCI-01775; QT Price: 0.27; Notes: Originally from Thomas, if not Ali; Price: 0.5

## Sheet rf_trsw.SchDoc: mcHF Pro Transceiver RF board
size A3; Author: Krassi Atanassov; CompanyName: MØNKA; Engineer: For radio amateurs experimentation, non-commercial use only. Thank you!; Revision: 0.8.5; SheetTotal: 14
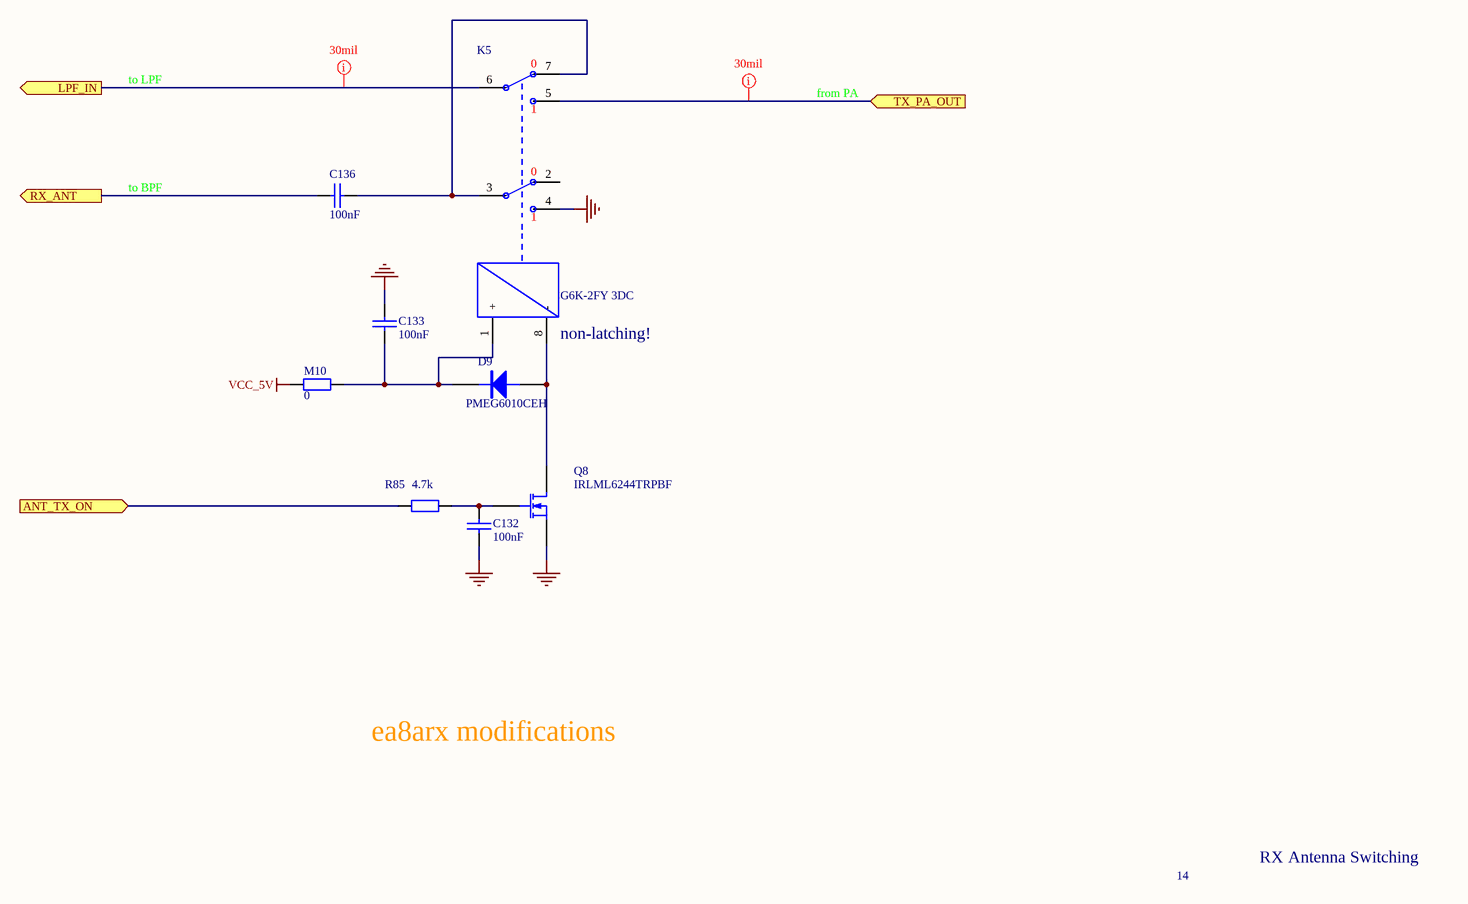
[diagram p12: rf_trsw.SchDoc]

### Parts
C132  100nF  [0805]
C133  100nF  [0805]
C136  100nF  [0805]
D9  PMEG6010CEH  [SOD87]
K5  G6K-2FY 3DC  [Omron_2FY]
M10  0  [0805]
Q8  IRLML6244TRPBF  [SOT-23-Pro]
R85  4.7k  [0805]

### Ports
ANT_TX_ON (in), LPF_IN (out), RX_ANT (out), TX_PA_OUT (in)

### Nets
GND: C132.1 C133.2 K5.4 Q8.2(S)
VCC_5V: M10.2
ANT_TX_ON: R85.1 ; port ANT_TX_ON
NetC132_2: C132.2 Q8.1(G) R85.2
NetC133_1: C133.1 D9.2(K) K5.1(+) M10.1
NetC136_1: C136.1 ; port RX_ANT
NetC136_2: C136.2 K5.3 K5.7
NetD9_1: D9.1(A) K5.8(-) Q8.3(D)
NetK5_5: K5.5 ; port TX_PA_OUT
NetK5_6: K5.6 ; port LPF_IN

Not connected (* = marked no-connect by the designer): K5 2

### Layout directives
rule Width Constraint [Pref Width = 30mil    Min Width = 30mil    Max Width = 30mil]: NetK5_5, NetK5_6

### Notes on the sheet
- to LPF
- from PA
- to BPF
- (near K5) non-latching!
- ea8arx modifications
- 14
- RX Antenna Switching
- Date:
- File:
- Revision:
- Sheet
- of
- Licence:
- (in symbol G6KU-2FY 3DC) 0

### Library data of the parts
C132 C133 = CAP: as C92 on sheet rf_tx_pa; Price: 0.068
C136 = CAP: Capacitor; Voltage: 100V
D9 = PMEG6010CEH: as D5 on sheet rf_tx_pa; Price: 0.085
K5 = G6KU-2FY 3DC: Single-winding Latching Relay; Notes: cheaper version from Ali; Price: 2.19
M10 = RES: Resistor; QT Order: QCR-00268; Price: 0.009
Q8 = MOSFET-N: as Q1 on sheet rf_conn; Price: 0.231
R85 = RES: Resistor; QT Order: QCR-00339; Price: 0.012